# EAGLE board KickerBoard-new-switchreg-rerouted (EAGLE 9.5.1), part 1 of 2
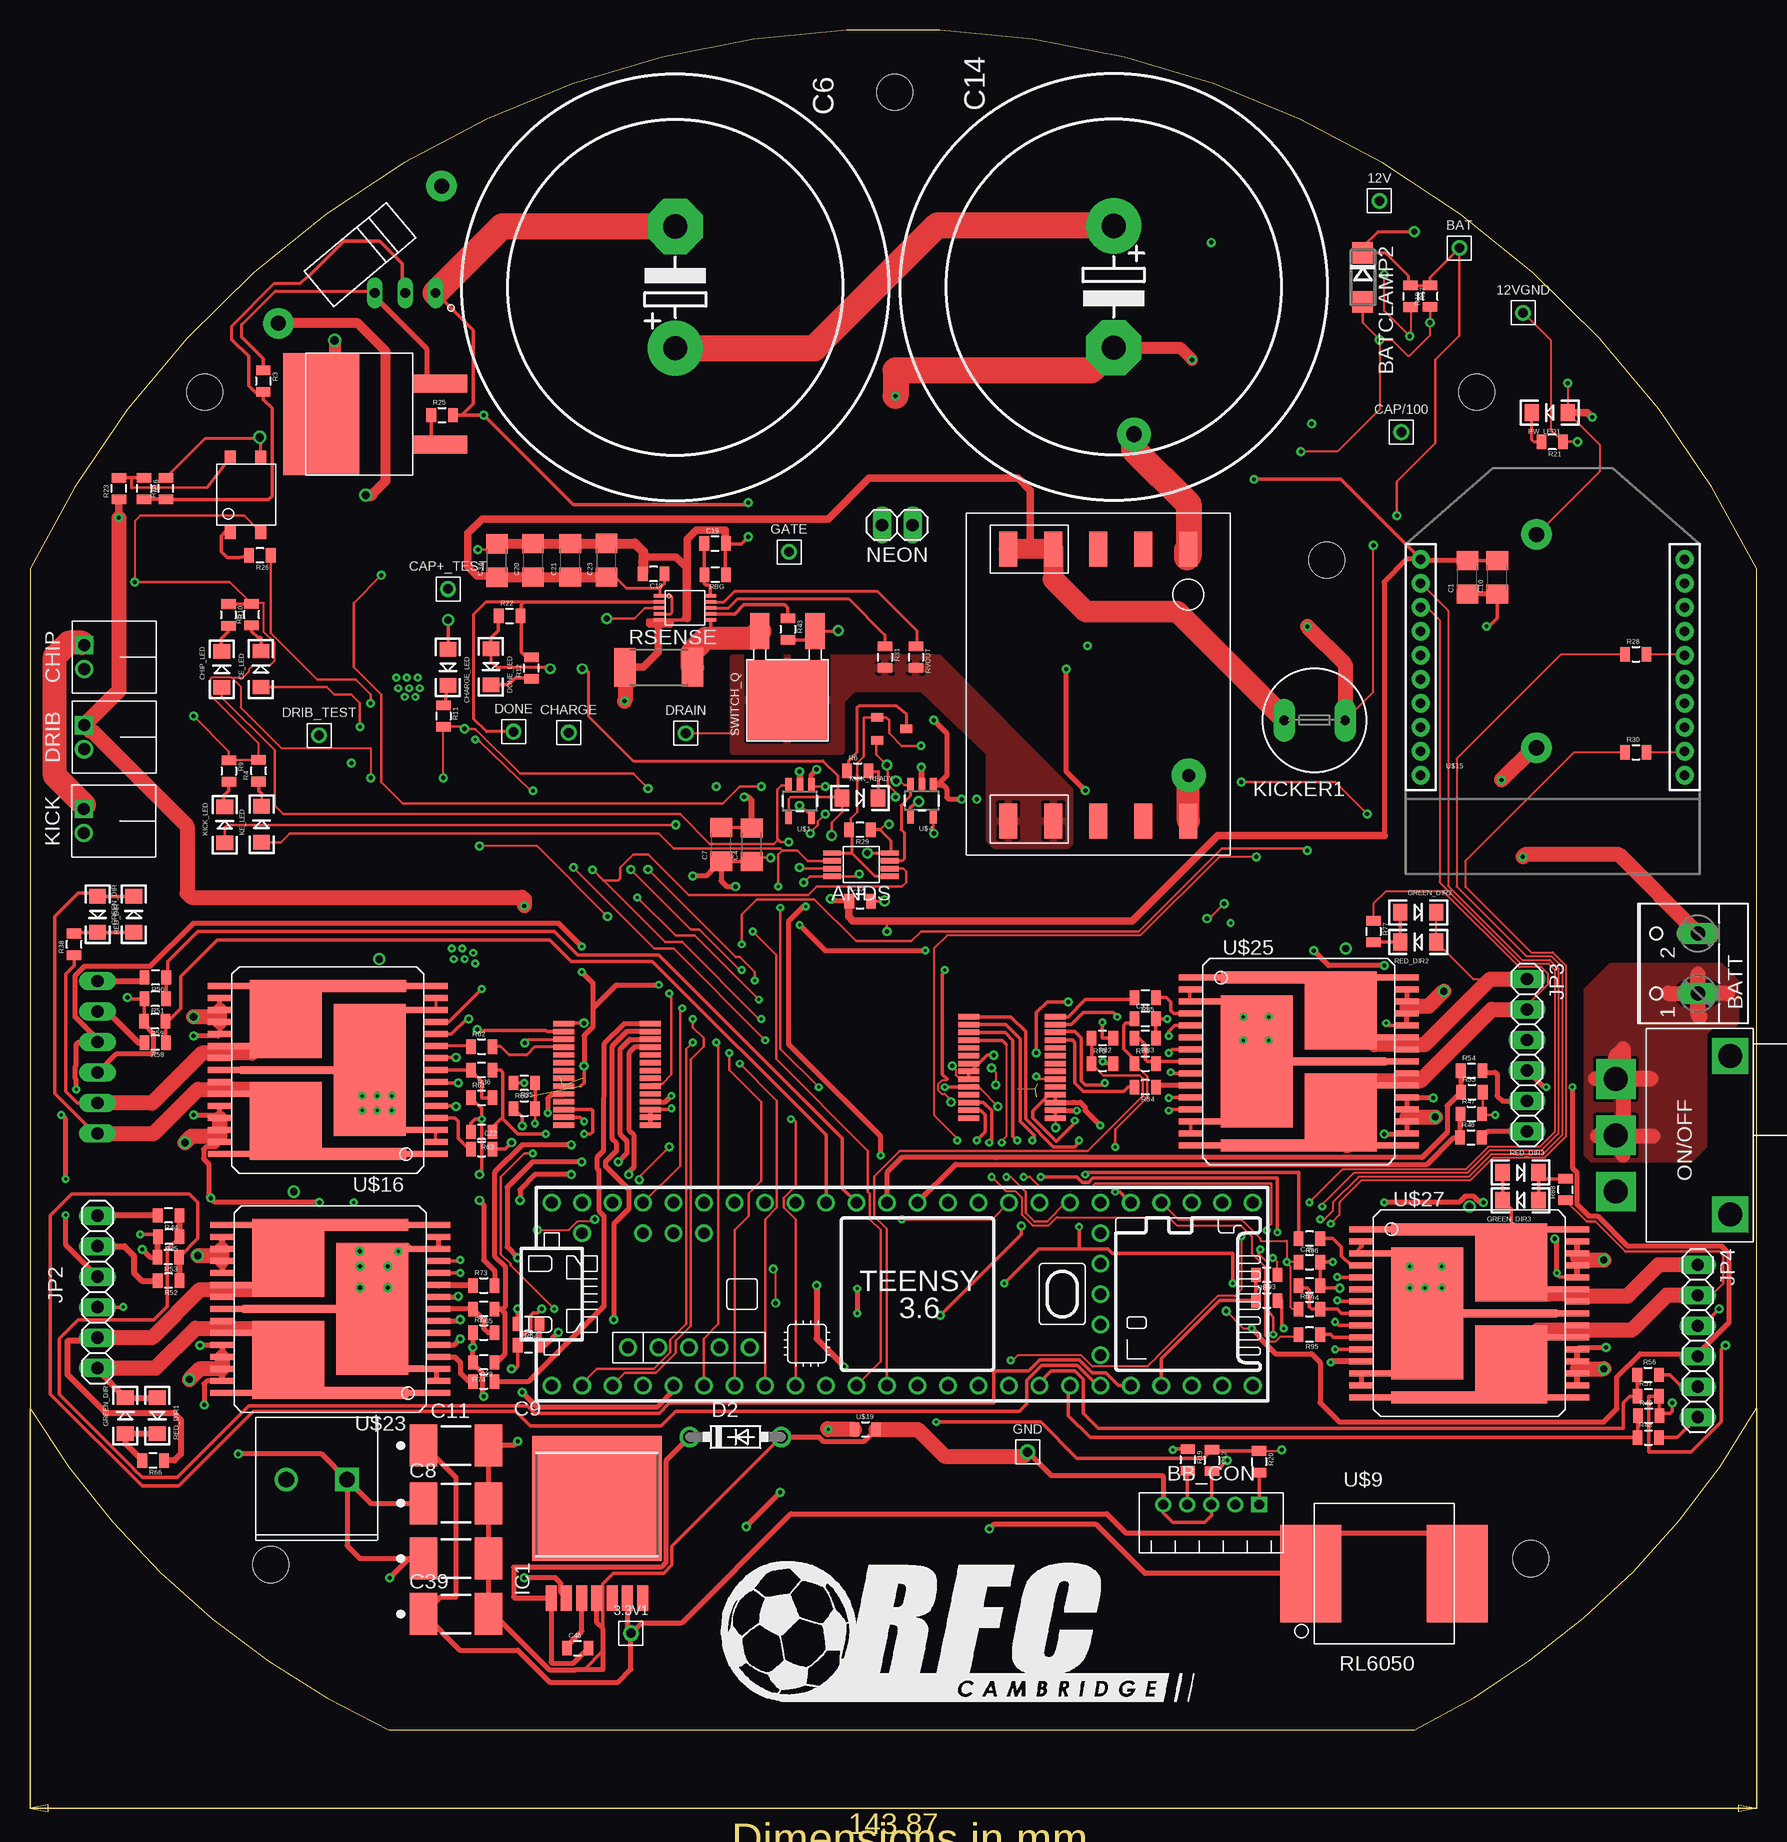
[diagram p3: board, top side]
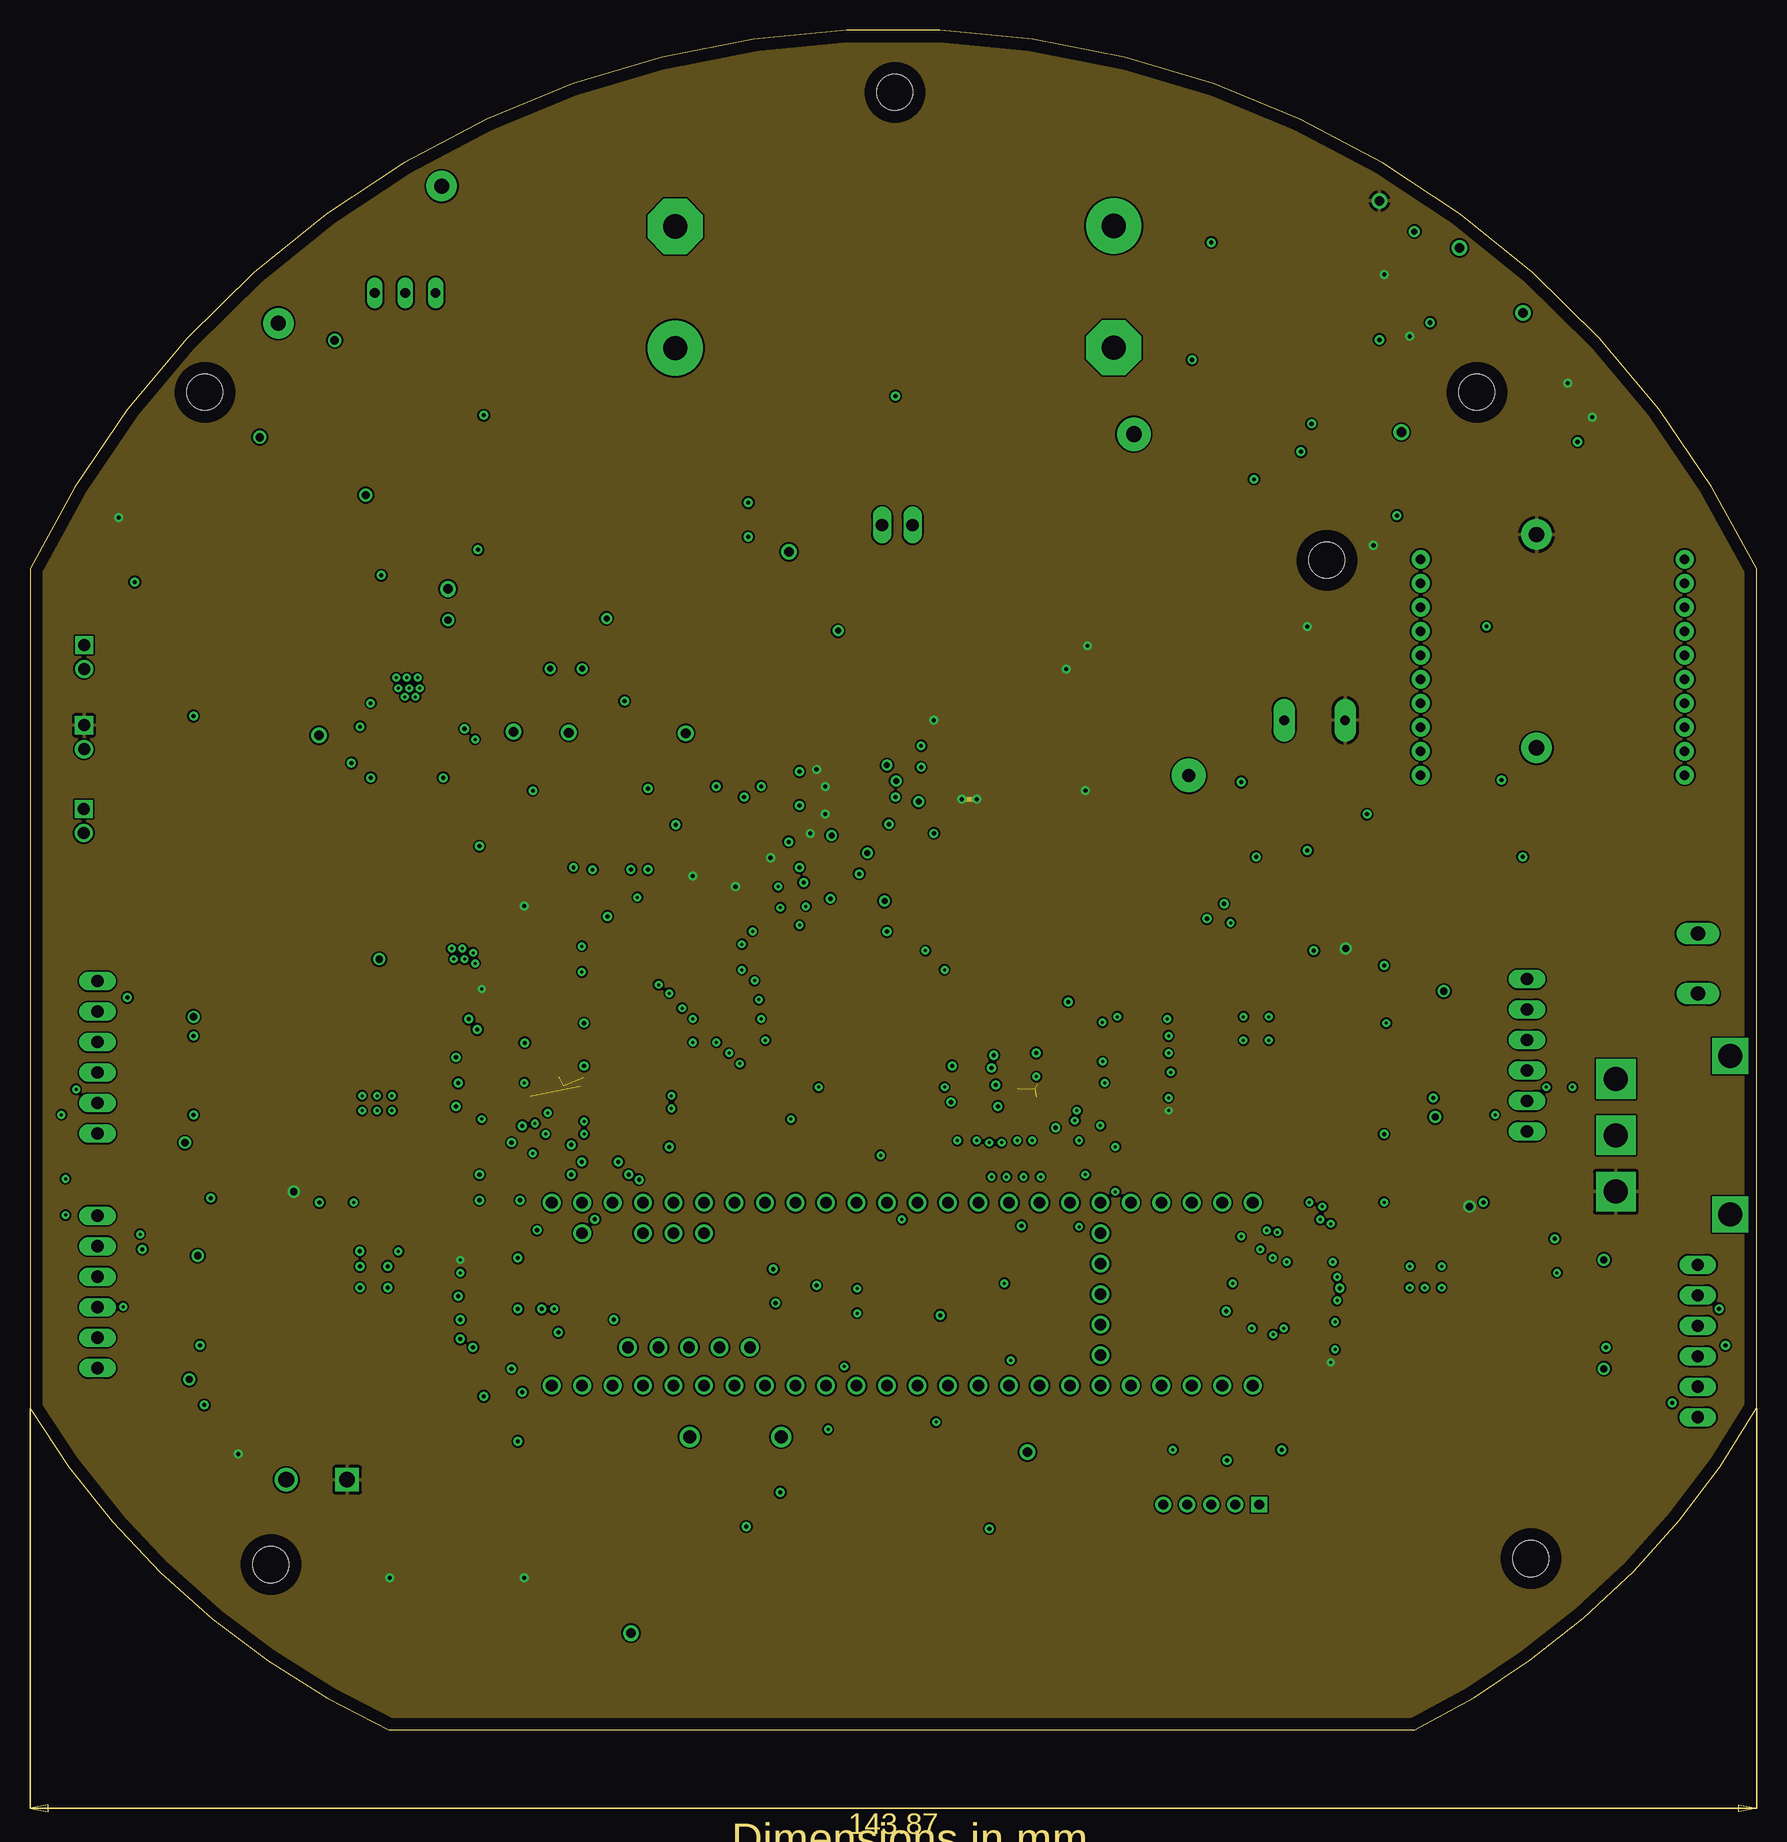
[diagram p4: board, inner layer 12V+]
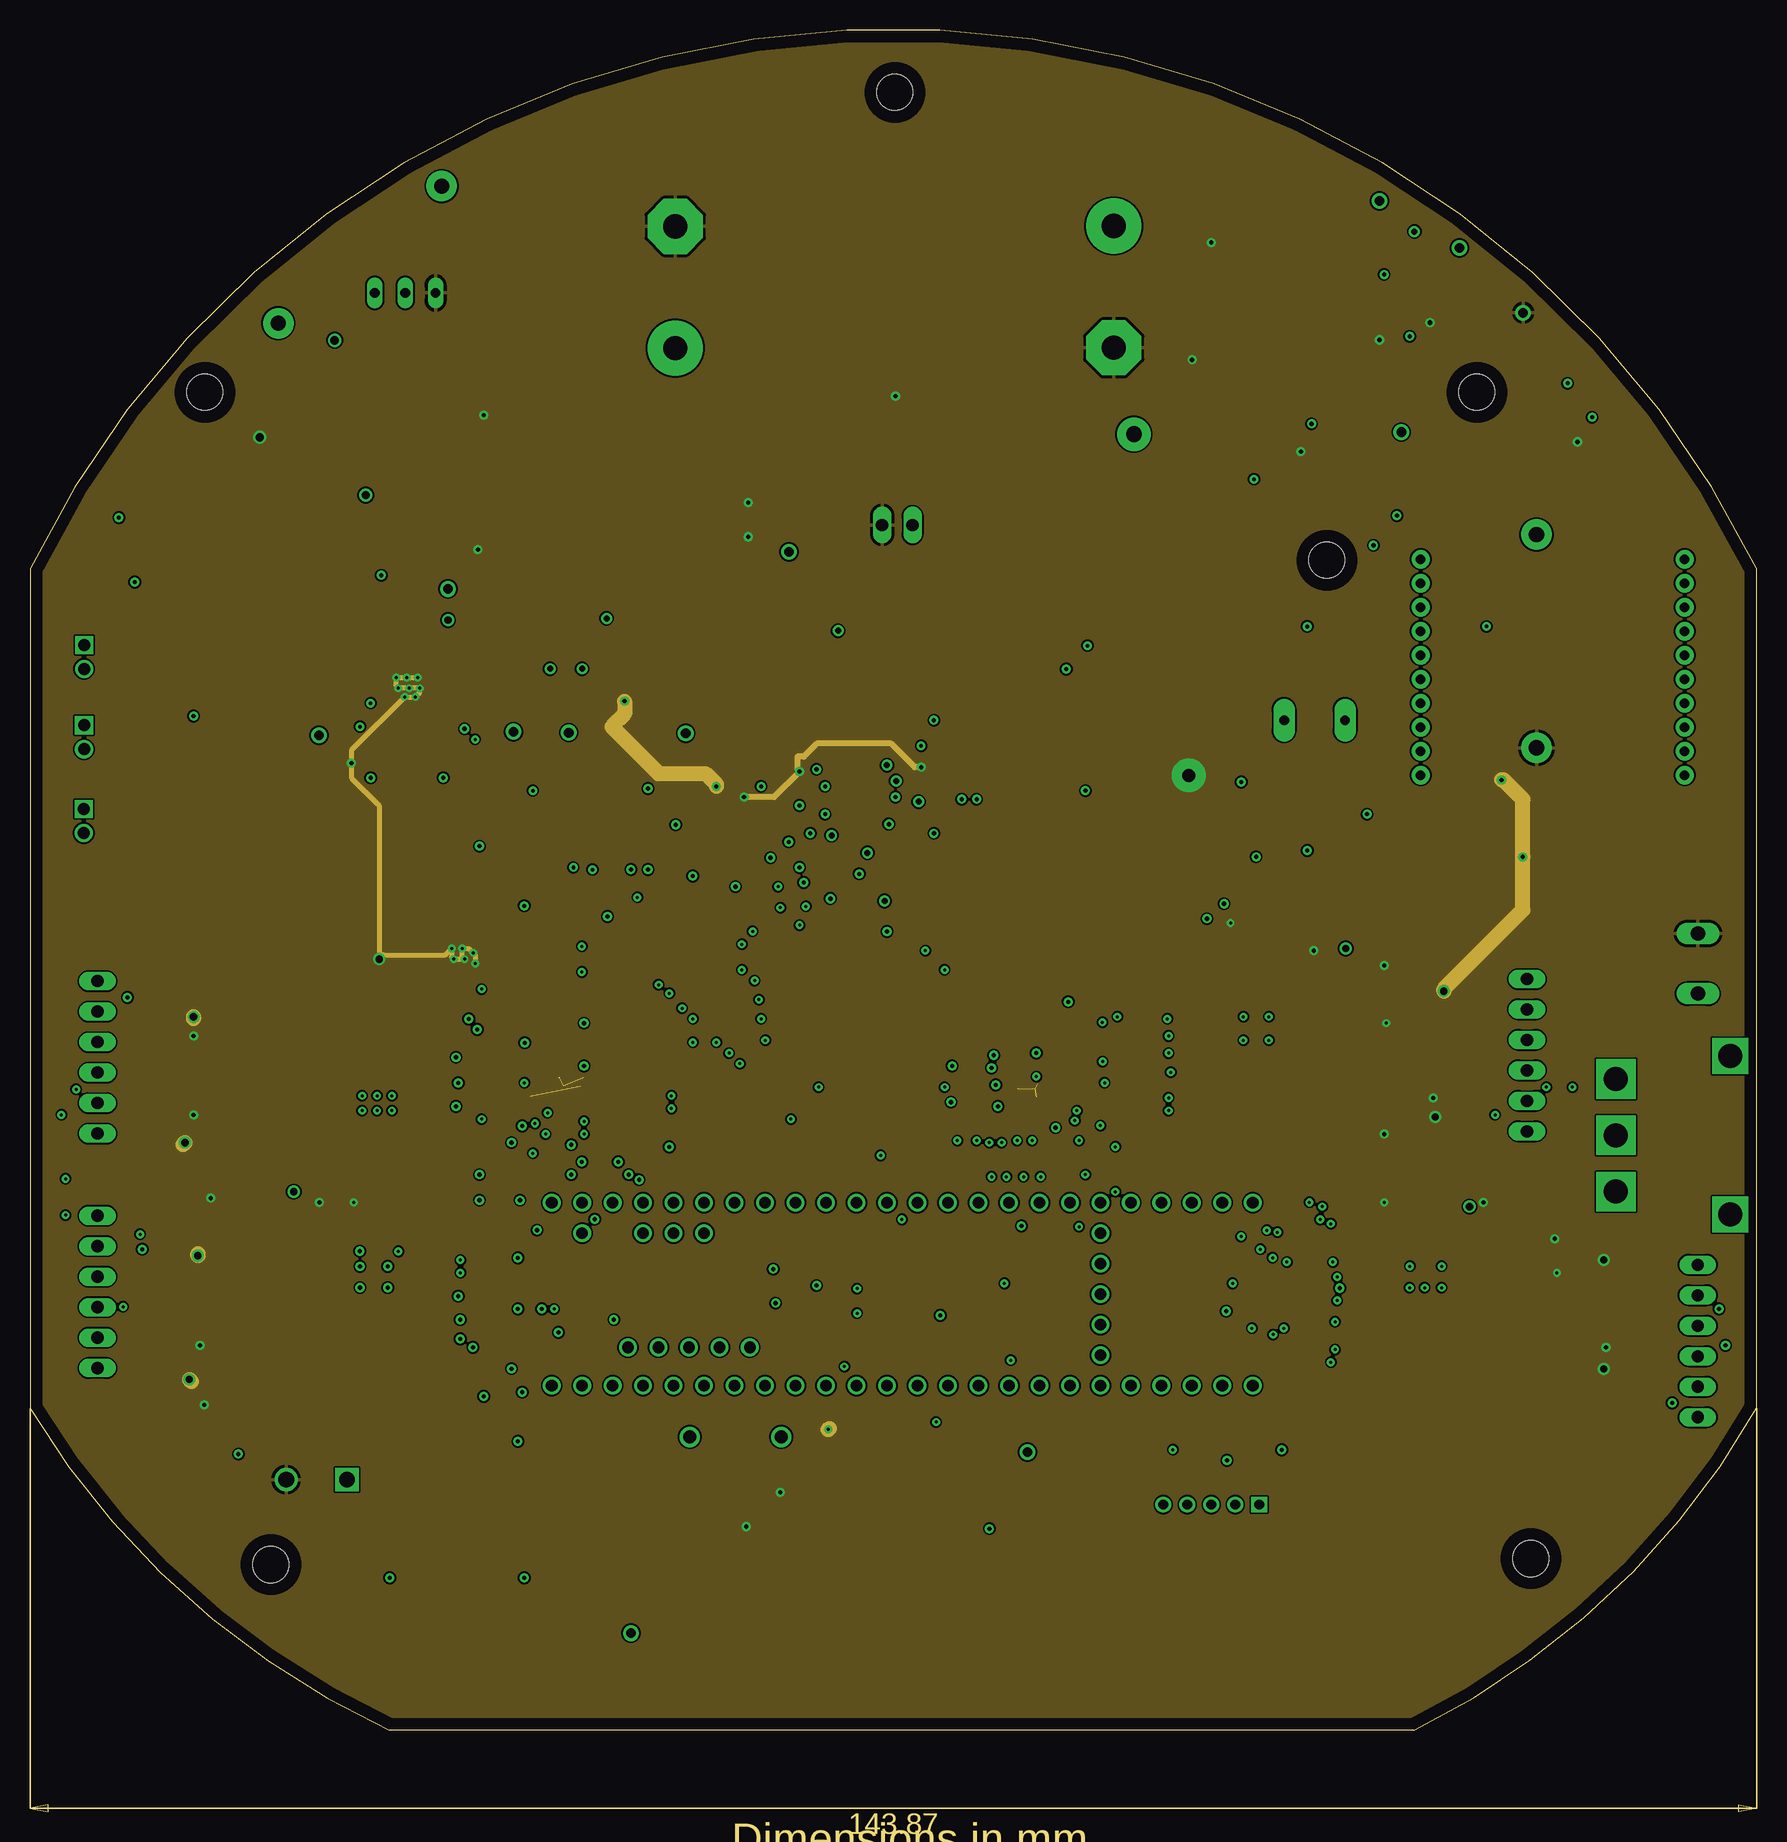
[diagram p5: board, inner layer 12VGND]
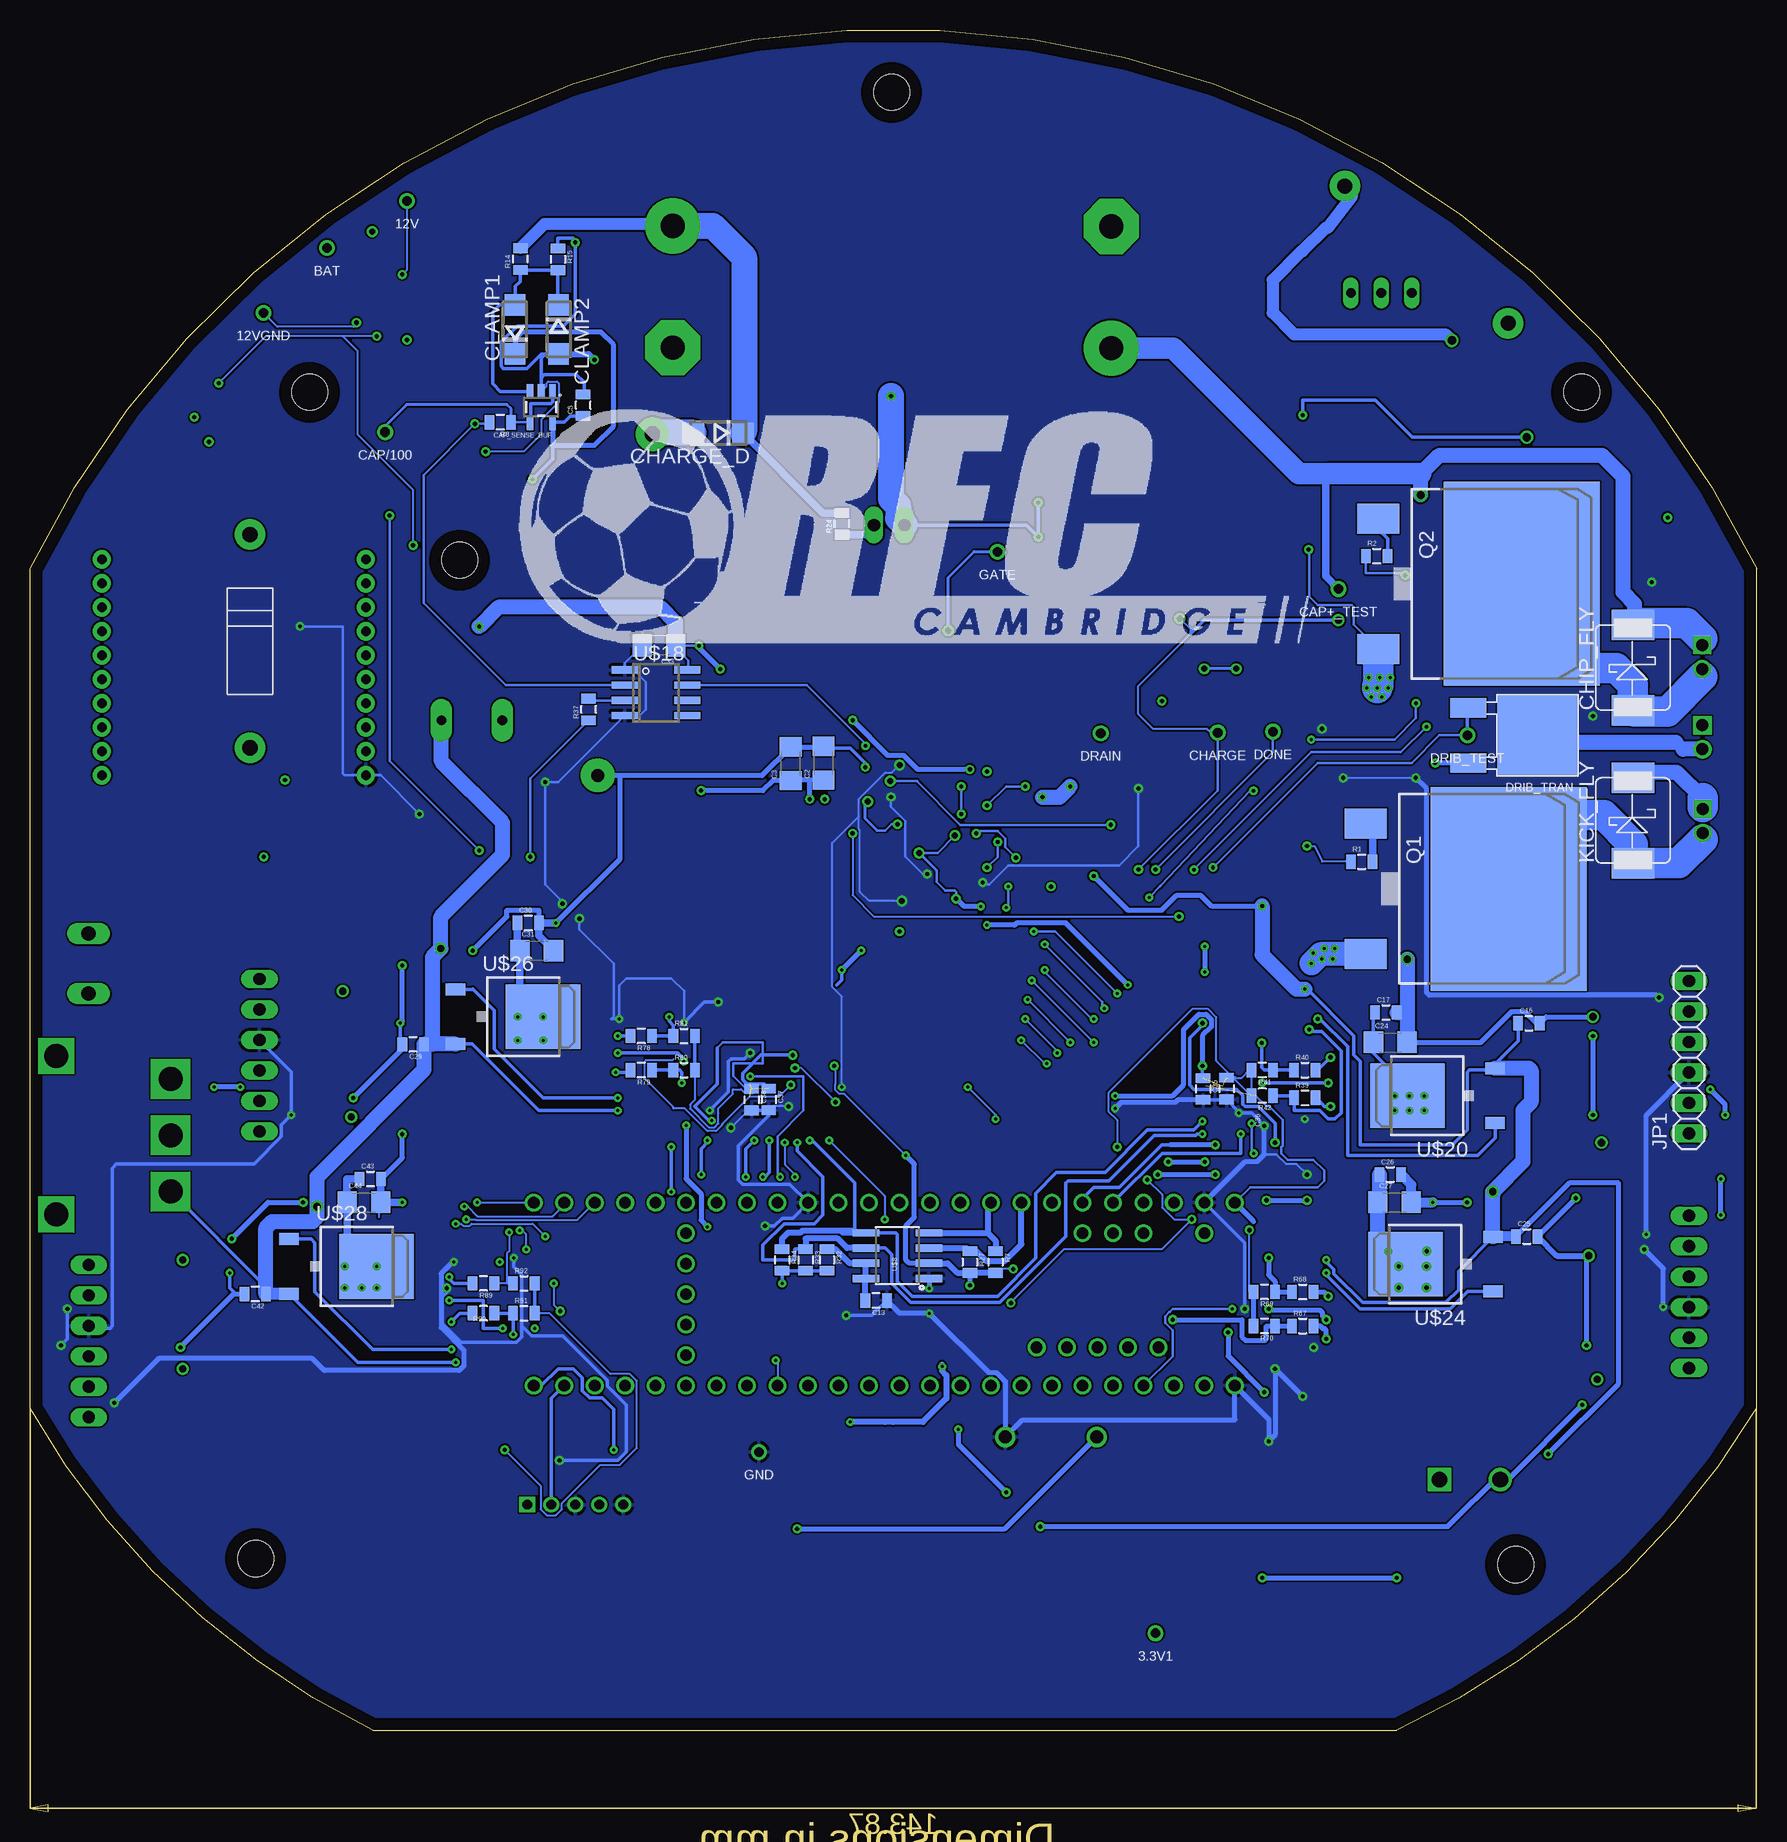
[diagram p6: board, bottom side, seen from below]

Size 143.88 x 141.72 mm. Coordinates in mm from the lower left corner, seen from the top.
Outline: 143.88,26.82 143.88,96.81 arc128 0,96.81 0,26.82 arc34 29.98,0 115.32,0 arc34 143.88,26.82
Copper layers (1*16): Top(3v3+) 0.035mm / dielectric 1.5mm / Bottom(3v3GND) 0.035mm
Design rules "default": minimum track width 6mil, minimum drill 0.35mm, track to track 6mil, track to pad 6mil, pad to pad 6mil, via to via 6mil, smd to smd 6mil, copper to edge 40mil, drill to drill 6mil, minimum pad ring 10mil, minimum via ring 8mil, stop-mask expansion 4mil, vias tented up to drill 0mil, thermal gap 10mil
Holes 3 mm at 125.07,14.3 20.07,13.8 14.57,111.52 72.07,136.52 108.07,97.52 120.57,111.52

## Footprints (pad centres in the part's own frame; a part is rotated, then mirrored left to right if it is on the bottom)
TESTING_PT = drill 0.8: P$1 0,0
TSSOP8 = smd 1.5 x 0.45: P$1 -2.4,0.975; P$2 -2.4,0.325; P$3 -2.4,-0.325; P$4 -2.4,-0.975; P$5 2.4,-0.975; P$6 2.4,-0.325; P$7 2.4,0.325; P$8 2.4,0.975
DO214AC = smd 1.8 x 1.7: A 2.05,0; C -2.05,0
W237-102 = drill 1.194 long: 1 -2.5,-1.27; 2 2.5,-1.27
JST-5-2MM = drill 0.8 square: 1 4,0 | drill 0.8: 2 2,0; 3 0,0; 4 -2,0; 5 -4,0
1206 = smd 1.6 x 1.8: 1 -1.4,0; 2 1.4,0
0805 = smd 0.8 x 1.2: 1 -0.9,0; 2 0.9,0
EB35D = drill 2.007 pad 4.597: + -5.08,0 | drill 2.007 pad 4.597 octagon: - 5.08,0
CAPCP7132X250N = smd 2.3 x 3.5: 1 -2.7,0; 2 2.7,0
SOT23-5 = smd 0.55 x 1.2: 1 -0.95,-1.3; 2 0,-1.3; 3 0.95,-1.3; 4 0.95,1.3; 5 -0.95,1.3
LED-1206 = smd 1.2 x 1.4: A -1.5,0; C 1.5,0
10-MSOP = smd 0.97 x 0.31: P$1 -0.485,-0.155; P$2 -0.485,-0.655; P$3 -0.485,-1.155; P$4 -0.485,-1.655; P$5 -0.485,-2.155; P$6 3.785,-2.155; P$7 3.785,-1.655; P$8 3.785,-1.155; P$9 3.785,-0.655; P$10 3.785,-0.155
JST-2-2MM = drill 1 square: 1 1,1 | drill 1: 2 -1,1
DO214AB = smd 2.54 x 3.556: ANODE 0,3.111; CATHODE 7.112,3.111
DO41-7.6 = drill 1.1 pad 1.7: A 3.81,0; C -3.81,0
DPAK = smd 6.7 x 6.7: DRAIN 0,0 | smd 3 x 1.6: GATE 5.75,-2.3; SOURCE 5.75,2.3
TO263-7 = smd 0.91 x 2.16: 1 -3.81,-5.78; 2 -2.54,-5.78; 3 -1.27,-5.78; 4 0,-5.78; 5 1.27,-5.78; 6 2.54,-5.78; 7 3.81,-5.78 | smd 10.8 x 10.41: 8 0,2.54
1X06 = drill 1.016 long: 1 -6.35,0; 2 -3.81,0; 3 -1.27,0; 4 1.27,0; 5 3.81,0; 6 6.35,0
TR5 = drill 0.813 pad 1.778 long: 1 -2.54,0; 2 2.54,0
1X02 = drill 1.016 long: 1 -1.27,0; 2 1.27,0
CK_SWITCH = drill 2 pad 3.302 square: COM 0,0; IN1 4.699,0; IN2 -4.699,0 | drill 2 pad 2.54 square: SUP1 -6.604,-9.525; SUP2 6.604,-9.525
TO268 = smd 8.5 x 13: C@1 -4.25,2.25; C@2 4.25,2.25 | smd 2.5 x 3.5: E 5.45,-9.7; G -5.45,-9.7
R2512 = smd 1.8 x 3.2: 1 -2.8,0; 2 2.8,0
TO-263 = smd 1.524 x 4.572: LOWER_LEFT 2.54,-2.286; LOWER_RIGHT 7.62,-2.286 | smd 10.16 x 6.35: TAB 5.08,7.62
10-TRANSFORMER = smd 2.92 x 1.52: P$1 0,0; P$2 0,-3.75; P$3 0,-7.5; P$4 0,-11.25; P$5 0,-15; P$6 22.67,-15; P$7 22.67,-11.25; P$8 22.67,-7.5; P$9 22.67,-3.75; P$10 22.67,0
SOP4 = smd 0.889 x 1.143: 1 0.813,-0.584; 2 3.353,-0.584; 3 3.353,5.664; 4 0.813,5.639
TO92 = drill 0.8 long: CENTER 2.54,0; LEFT 0,0; RIGHT 5.08,0
THROUGH-HOLE-2 = drill 1.27 pad 2.54: + 0,0; - 17.78,0
SOIC8 = smd 0.61 x 2.21: 1 -1.905,-2.616; 2 -0.635,-2.616; 3 0.635,-2.616; 4 1.905,-2.616; 5 1.905,2.616; 6 0.635,2.616; 7 -0.635,2.616; 8 -1.905,2.616
RL6050 = smd 5.08 x 8.12: P$1 -6.1,0; P$2 6.1,0
1X02-PHEONIX = drill 1.3 square: 1 0,0 | drill 1.3: 2 5.08,0
TEENSY_3.5/3.6 = drill 0.965: 0/RX -25.4,-7.62; 1/TX -22.86,-7.62; 2 -20.32,-7.62; 3/CANTX -17.78,-7.62; 3V3 7.62,-7.62; 3V3_2 17.78,-2.54; 3V3_LO -22.86,7.62; 4/CANRX -15.24,-7.62; 5 -12.7,-7.62; 6 -10.16,-7.62; 7 -7.62,-7.62; 8 -5.08,-7.62; 9/CS -2.54,-7.62; 10/CS 0,-7.62; 11/MOSI 2.54,-7.62; 12/MISO 5.08,-7.62; 13/SCK 5.08,7.62; 14/A0 2.54,7.62; 15/A1 0,7.62; 16/A2 -2.54,7.62; 17/A3 -5.08,7.62; 18/A4/SDA -7.62,7.62; 19/A5/SCL -10.16,7.62; 20/A6 -12.7,7.62; 21/A7 -15.24,7.62; 21/DAC0 12.7,7.62; 22/A8 -17.78,7.62; 23/A9 -20.32,7.62; 24 10.16,-7.62; 25 12.7,-7.62; 26 15.24,-7.62; 27 17.78,-7.62; 28 20.32,-7.62; 29 22.86,-7.62; 30 25.4,-7.62; 31/A12 27.94,-7.62; 32/A13 30.48,-7.62; 33/A14 30.48,7.62; 34/A15 27.94,7.62; 35/A16 25.4,7.62; 36/A17 22.86,7.62; 37/A18 20.32,7.62; 38/A19 17.78,7.62; 39/A20 15.24,7.62; A10 -17.78,5.08; A11 -15.24,5.08; A22/DAC1 10.16,7.62; AGND -25.4,7.62; AREF -20.32,5.08; GND -27.94,-7.62; GND2 7.62,7.62; GND3 17.78,0; PROG 17.78,2.54; RESET 17.78,5.08; U5V -21.59,-4.445; UD+ -16.51,-4.445; UD- -19.05,-4.445; UGND1 -13.97,-4.445; UGND2 -11.43,-4.445; VBAT 17.78,-5.08; VIN -27.94,7.62; VUSB -25.4,5.08
XBEE-1 = drill 0.8 pad 1.524: 1 -11,20; 2 -11,18; 3 -11,16; 4 -11,14; 5 -11,12; 6 -11,10; 7 -11,8; 8 -11,6; 9 -11,4; 10 -11,2; 11 11,2; 12 11,4; 13 11,6; 14 11,8; 15 11,10; 16 11,12; 17 11,14; 18 11,16; 19 11,18; 20 11,20
MULTIPOWERSO-30 = smd 0.508 x 12: 1 -7,-4; 15 7,-4; 16 7,4; 30 -7,4 | smd 0.508 x 2: 2 -6,-9; 4 -4,-9; 5 -3,-9; 6 -2,-9; 7 -1,-9; 8 0,-9; 9 1,-9; 10 2,-9; 11 3,-9; 12 4,-9; 14 6,-9; 17 6,9; 18 5,9; 19 4,9; 20 3,9; 22 1,9; 24 -1,9; 26 -3,9; 27 -4,9; 28 -5,9; 29 -6,9 | smd 0.508 x 4: 3 -5,-8; 13 5,-8; 21 2,8; 23 0,8; 25 -2,8 | smd 6.5 x 6: OUTA -4.25,3.5; OUTB 4.25,3.5 | smd 1 x 7.5: OUTA@1 -7,-2.755; OUTB@1 7,-2.755 | smd 11 x 6: VCC 0,-3.5 | smd 0.65 x 8.3: VCC@1 0,3.145
SSOP = smd 0.45 x 1.75: 1 0,0; 2 0.65,0; 3 1.3,0; 4 1.95,0; 5 2.6,0; 6 3.25,0; 7 3.9,0; 8 4.55,0; 9 5.2,0; 10 5.85,0; 11 6.5,0; 12 7.15,0; 13 7.8,0; 14 8.45,0; 15 8.45,7.2; 16 7.8,7.2; 17 7.15,7.2; 18 6.5,7.2; 19 5.85,7.2; 20 5.2,7.2; 21 4.55,7.2; 22 3.9,7.2; 23 3.25,7.2; 24 2.6,7.2; 25 1.95,7.2; 26 1.3,7.2; 27 0.65,7.2; 28 0,7.2
SOIC8' = smd 0.6 x 2.2: 1 -1.905,-2.6; 2 -0.635,-2.6; 3 0.635,-2.6; 4 1.905,-2.6; 5 1.905,2.6; 6 0.635,2.6; 7 -0.635,2.6; 8 -1.905,2.6
TO252-3 = smd 1 x 1.6: 1 -2.28,-6.07; 2 2.28,-6.07 | smd 5.4 x 6.2: 3 0,1.23
SOT-23 = smd 1 x 0.7: D 0,0; G -2.4,0.95; S -2.4,-0.95

## Placement (x,y rotation side)
3.3V1  TEST_PT  [TESTING_PT]  50.08,8.08 0 top
12V  TEST_PT  [TESTING_PT]  112.46,127.47 0 top
12VGND  TEST_PT  [TESTING_PT]  124.43,118.15 0 top
ANDS  AND-DUAL  [TSSOP8]  69.25,72.14 0 top
BAT  TEST_PT  [TESTING_PT]  119.12,123.54 0 top
BATCLAMP2  DIODE-ZENERDO214AC  [DO214AC]  111.06,121.1 270 top
BATT  [W237-102]  137.72,63.91 90 top
BB_CON  JST-5  [JST-5-2MM]  98.43,18.79 0 top
C1  1uF  [1206]  119.78,96.09 90 top
C2  .1uF  [1206]  77.74,80.61 90 bottom
C3  10uF  [1206]  80.48,80.56 90 bottom
C4  .1uF  [1206]  60.15,73.81 90 top
C5  .1uF  [0805]  97.78,110.45 90 bottom
C6  1500uF  [EB35D]  53.78,120.27 90 top
C7  10uF  [1206]  57.6,73.83 90 top
C8  594D127X06R3C2T(15UF)  [CAPCP7132X250N]  35.5,18.93 0 top
C9  594D127X06R3C2T(15UF)  [CAPCP7132X250N]  35.5,14.3 0 top
C10  .01uF  [1206]  122.27,96.09 90 top
C11  594D127X06R3C2T(180UF)  [CAPCP7132X250N]  35.5,23.73 0 top
C12  4.7uF  [0805]  98.49,22.48 270 top
C13  100nF  [0805]  73.37,35.82 180 bottom
C14  1500uF  [EB35D]  90.31,120.31 270 top
C15  .1uF  [0805]  69.17,69.1 0 top
C16  0.1uF  [0805]  18.96,58.93 0 bottom
C17  0.1uF  [0805]  30.88,59.82 0 bottom
C18  10uF  [0805]  51.96,96.38 180 top
C19  100pF  [0805]  57.09,98.92 0 top
C20  47uF  [1206]  41.93,97.51 90 top
C21  47uF  [1206]  45.02,97.52 90 top
C22  33nF  [0805]  37.63,49.86 180 top
C23  47uF  [1206]  48.04,97.52 90 top
C24  47uF  [1206]  30.52,57.33 0 bottom
C25  0.1uF  [0805]  19.14,41.15 0 bottom
C26  0.1uF  [0805]  30.52,46.31 0 bottom
C27  47uF  [1206]  30.17,44 0 bottom
C28  33nF  [0805]  37.81,30.66 180 top
C29  0.1uF  [0805]  111.95,57.15 180 bottom
C30  0.1uF  [0805]  102.35,67.29 0 bottom
C31  47uF  [1206]  101.64,64.98 0 bottom
C32  33nF  [0805]  92.93,59.29 0 top
C33  1uF  [1206]  91.47,90.41 180 bottom
C34  47uF  [1206]  38.9,97.49 90 top
C35  100nF  [0805]  46.12,53.45 270 bottom
C36  2.2uF  [0805]  44.16,53.47 270 bottom
C37  100nF  [0805]  82.31,52.58 270 bottom
C38  2.2uF  [0805]  83.73,52.56 270 bottom
C39  594D127X06R3C2T(180UF)  [CAPCP7132X250N]  35.5,9.68 0 top
C42  0.1uF  [0805]  125.11,36.35 180 bottom
C43  0.1uF  [0805]  115.51,45.95 0 bottom
C44  47uF  [1206]  116.04,44 0 bottom
C45  33nF  [0805]  106.62,39.02 0 top
C46  .01uF  [0805]  45.63,6.84 0 top
CAP+_TEST  TEST_PT  [TESTING_PT]  34.85,95.12 0 top
CAP/100  TEST_PT  [TESTING_PT]  114.28,108.2 0 top
CAP_SENSE_BUF  MCP6291T-E/OT  [SOT23-5]  101.27,110.28 180 bottom
CE_LED  [LED-1206]  19.24,88.45 90 top
CHARGE  TEST_PT  [TESTING_PT]  44.9,83.15 0 top
CHARGE_D  1kV, ultrafast  [DO214AC]  86.52,108.14 180 bottom
CHARGE_LED  [LED-1206]  34.83,88.6 270 top
CHARGE_U  LT3750  [10-MSOP]  52.93,94.7 0 top
CHIP  JST-22MM  [JST-2-2MM]  5.51,89.46 90 top
CHIP_FLY  DIODE-ZENERDO214AB  [DO214AB]  7.19,85.02 90 bottom
CHIP_LED  [LED-1206]  15.99,88.43 90 top
CLAMP1  DIODE-ZENERDO214AC  [DO214AC]  103.45,116.75 90 bottom
CLAMP2  DIODE-ZENERDO214AC  [DO214AC]  99.84,116.76 270 bottom
D2  1N5817-B  [DO41-7.6]  58.79,24.44 0 top
DONE  TEST_PT  [TESTING_PT]  40.3,83.23 0 top
DONE_LED  [LED-1206]  38.41,88.65 270 top
DRAIN  TEST_PT  [TESTING_PT]  54.65,83.11 0 top
DRIB  JST-22MM  [JST-2-2MM]  5.5,82.76 90 top
DRIB_TEST  TEST_PT  [TESTING_PT]  24.09,82.92 0 top
DRIB_TRAN  [DPAK]  18.26,82.92 180 bottom
GATE  TEST_PT  [TESTING_PT]  63.25,98.21 0 top
GND  TEST_PT  [TESTING_PT]  83.13,23.19 0 top
GREEN_DIR  [LED-1206]  8.65,68 90 top
GREEN_DIR1  [LED-1206]  7.94,26.22 90 top
GREEN_DIR2  [LED-1206]  115.69,68.18 0 top
GREEN_DIR3  [LED-1206]  124.22,44.17 180 top
IC1  LM2678S  [TO263-7]  47.24,16.79 0 top
JP1  [1X06]  5.63,56.09 90 bottom
JP2  [1X06]  5.63,36.53 90 top
JP3  [1X06]  124.76,56.26 270 top
JP4  [1X06]  138.98,32.44 270 top
KE_LED  [LED-1206]  19.3,75.51 90 top
KICK  JST-22MM  [JST-2-2MM]  5.49,75.79 90 top
KICK_FLY  DIODE-ZENERDO214AB  [DO214AB]  7.19,72.28 90 bottom
KICK_LED  [LED-1206]  16.23,75.47 90 top
KICK_READY  [LED-1206]  69.18,77.69 0 top
KICKER1  [TR5]  107.05,84.19 180 top
NEON  [1X02]  72.28,100.46 180 top
ON/OFF  SPDT-SWITCH  [CK_SWITCH]  132.15,49.59 90 top
PW_LED1  [LED-1206]  126.64,109.83 180 top
Q1  IXFT94N30P3  [TO268]  22.88,70.13 270 bottom
Q2  IXFT94N30P3  [TO268]  21.81,95.56 270 bottom
R1  100  [0805]  32.89,72.39 0 bottom
R2  100  [0805]  31.65,97.87 0 bottom
R3  250k  [0805]  19.44,112.45 270 top
R4  1k  [0805]  19.05,79.97 90 top
R5  1k  [0805]  18.47,93 90 top
R6  1k  [0805]  68.99,79.98 0 top
R7  4.7k  [0805]  63.41,39.02 270 bottom
R8  1k  [0805]  104.69,109.02 180 bottom
R9  1k  [0805]  16.58,79.94 270 top
R10  1k  [0805]  16.53,92.97 270 top
R11  1k  [0805]  34.45,84.53 270 top
R12  1k  [0805]  41.79,88.54 90 top
R13  2.5k  [0805]  11.33,103.5 90 top
R14  1M  [0805]  103.01,122.64 90 bottom
R15  10K  [0805]  99.88,122.6 270 bottom
R16  1k  [0805]  9.5,103.5 270 top
R17  80k  [0805]  115.05,119.52 270 top
R18  20k  [0805]  116.68,119.54 90 top
R19  20  [0805]  96.48,22.54 270 top
R20  100  [0805]  102.42,22.38 270 top
R21  1k  [0805]  126.85,107.37 180 top
R22  100k  [0805]  39.97,92.88 0 top
R23  1.5k  [0805]  7.4,103.5 90 top
R24  536k  [0805]  76.22,100.56 90 bottom
R25  200  [0805]  34.34,109.61 0 top
R26  300  [0805]  19.16,97.93 180 top
R27  4.7k  [0805]  65.55,39.02 270 bottom
R28  0  [0805]  133.82,89.69 0 top
R29  1M  [0805]  69.16,75.05 180 top
R30  0  [0805]  133.82,81.51 0 top
R31  43k  [0805]  71.25,89.44 270 top
R32  200k  [0805]  77.46,39.2 270 bottom
R33  4.7k  [0805]  79.24,39.2 270 bottom
R34  4.7k  [0805]  81.19,39.2 270 bottom
R35  1k  [0805]  41.19,53.95 180 top
R36  10k  [0805]  37.63,55.02 180 top
R37  100k  [0805]  97.32,85.09 90 bottom
R38  4.7k  [0805]  3.67,65.51 90 top
R39  1k  [0805]  37.63,52.71 0 bottom
R40  1k  [0805]  37.63,55.02 0 bottom
R41  1k  [0805]  41.19,55.02 180 bottom
R42  1k  [0805]  41.19,52.89 180 bottom
R43  100  [0805]  63.16,91.77 270 top
R44  39k  [0805]  11.55,42.9 180 top
R45  75k  [0805]  11.57,41.13 180 top
R46  39k  [0805]  120.08,49.41 0 top
R47  75k  [0805]  120.11,51.36 0 top
R48  39k  [0805]  134.87,24.39 0 top
R49  75k  [0805]  134.89,26.22 0 top
R50  39k  [0805]  10.46,62.74 180 top
R51  75k  [0805]  10.43,60.96 180 top
R52  39k  [0805]  11.55,37.47 180 top
R53  75k  [0805]  11.52,39.42 180 top
R54  39k  [0805]  120.13,54.97 0 top
R55  75k  [0805]  120.16,53.19 0 top
R56  39k  [0805]  134.84,29.62 0 top
R57  75k  [0805]  134.87,27.84 0 top
R58  39k  [0805]  10.43,57.31 180 top
R59  75k  [0805]  10.41,59.08 180 top
R60  10k  [0805]  41.19,51.82 0 top
R61  1k  [0805]  37.63,52.71 0 top
R62  1k  [0805]  37.63,56.98 0 top
R63  1k  [0805]  37.63,48.44 0 top
R64  1k  [0805]  41.55,33.86 180 top
R65  10k  [0805]  37.81,35.11 180 top
R66  4.7k  [0805]  10.25,22.48 180 top
R67  1k  [0805]  37.81,33.68 0 bottom
R68  1k  [0805]  37.81,36.53 0 bottom
R69  1k  [0805]  41.01,36.53 180 bottom
R70  1k  [0805]  41.01,33.68 180 bottom
R71  10k  [0805]  41.55,32.08 0 top
R72  1k  [0805]  37.81,33.15 0 top
R73  1k  [0805]  37.81,37.06 0 top
R74  1k  [0805]  37.81,29.06 0 top
R75  1k  [0805]  89.37,55.55 0 top
R76  10k  [0805]  92.93,55.55 0 top
R77  4.7k  [0805]  111.95,66.58 270 top
R78  1k  [0805]  92.93,57.87 180 bottom
R79  1k  [0805]  92.93,55.02 180 bottom
R80  1k  [0805]  89.37,55.02 0 bottom
R81  1k  [0805]  89.37,57.87 0 bottom
R82  10k  [0805]  89.37,57.69 180 top
R83  1k  [0805]  92.93,57.69 180 top
R84  1k  [0805]  92.93,53.6 180 top
R85  1k  [0805]  92.93,61.07 180 top
R86  1k  [0805]  103.06,35.82 0 top
R87  10k  [0805]  106.62,35.11 0 top
R88  4.7k  [0805]  127.96,45.06 90 top
R89  1k  [0805]  106.09,37.24 180 bottom
R90  1k  [0805]  106.09,34.75 180 bottom
R91  1k  [0805]  102.71,34.75 0 bottom
R92  1k  [0805]  102.71,37.24 0 bottom
R93  10k  [0805]  103.06,37.95 180 top
R94  1k  [0805]  106.62,37.06 180 top
R95  1k  [0805]  106.62,32.97 180 top
R96  1k  [0805]  106.62,40.97 180 top
RBG  2.49k  [0805]  57.1,96.31 180 top
RED_DIR  [LED-1206]  5.63,68 270 top
RED_DIR1  [LED-1206]  10.61,26.22 270 top
RED_DIR2  [LED-1206]  115.69,65.69 180 top
RED_DIR3  [LED-1206]  124.22,46.49 0 top
RSENSE  10m  [R2512]  52.39,88.59 0 top
RVOUT  50.4k  [0805]  73.83,89.44 270 top
SWITCH_Q  [DPAK]  63.12,85.86 90 top
U$1  FAN31111  [SOT23-5]  64.17,77.45 180 top
U$2  IXTA3N50D2  [TO-263]  31.88,104.62 90 top
U$3  32052-TRANSFORMER  [10-TRANSFORMER]  96.53,98.46 270 top
U$4  FAN31111  [SOT23-5]  74.32,77.49 180 top
U$5  VO1400AEFTR  [SOP4]  15.88,100.44 0 top
U$6  ZTX718  [TO92]  33.81,119.81 180 top
U$7  1N4007  [THROUGH-HOLE-2]  20.69,117.28 40 top
U$8  PCA9306  [SOIC8]  71.59,39.55 90 bottom
U$9  RL6050  [RL6050]  112.84,13.06 0 top
U$12  13VZENER  [THROUGH-HOLE-2]  125.55,81.88 90 bottom
U$13  PHEONIX-SCREW-TERM  [1X02-PHEONIX]  26.43,20.88 180 top
U$14  TEENSY_3.5/3.6  [TEENSY_3.5/3.6]  71.42,36.35 0 top
U$15  XBEE-1B1  [XBEE-1]  126.89,77.6 0 top
U$16  VNH5019  [MULTIPOWERSO-30]  24.83,55.02 90 top
U$17  IO-EXPANDER  [SSOP]  44.49,58.88 270 top
U$18  LM311  [SOIC8']  91.71,86.48 270 bottom
U$19  INDUCTOR  [0805]  69.61,25.07 0 top
U$20  MOSFET-NCH  [TO252-3]  27.85,52.89 90 bottom
U$21  IO-EXPANDER  [SSOP]  78.25,59.47 270 top
U$22  N-FET  [SOT-23]  73.02,83.47 0 top
U$23  VNH5019  [MULTIPOWERSO-30]  25.01,35.11 90 top
U$24  MOSFET-NCH  [TO252-3]  28.03,38.84 90 bottom
U$25  VNH5019  [MULTIPOWERSO-30]  105.73,55.73 270 top
U$26  MOSFET-NCH  [TO252-3]  102.35,59.47 270 bottom
U$27  VNH5019  [MULTIPOWERSO-30]  119.96,34.75 270 top
U$28  MOSFET-NCH  [TO252-3]  116.22,38.66 270 bottom

## Tracks (layer width: path | path; a pad name or v marks a point on that pad's centre or on a via)
3.3V  (via drill 0.25, 0.3, 0.35, 0.38, 0.5)  (5 unrouted)
  Top(3v3+) 0.152: v42.26,41.69 44.91,41.69 45.62,42.4 46.88,42.4 v47.07,42.59 47.23,42.75 | v62.13,35.6 62.13,38.34 61.99,38.48 v61.94,38.43 | v76.84,55.38 77.14,55.07 77.14,54.6 77.47,54.27 U$21.9 | v53.28,48.62 50.79,46.13 50.79,45.91 v50.76,45.88 | R20.1 104.22,23.28 v104.31,23.37
  Top(3v3+) 0.203: U$1.4 63.22,76.89 63.24,76.91 63.24,77.6 63.41,77.78 67.59,77.78 KICK_READY.A | C15.1 68.22,69.1 | 70.12,75.11 70.91,75.11 71.31,75.52 v71.57,75.52 | 67.33,77.69 KICK_READY.A | KICK_READY.A 67.68,76.53 66.79,75.64 v66.79,74.58 | 71.42,67.47 v71.42,66.58
  Top(3v3+) 0.254: v69.79,73.13 71.64,73.13 ANDS.P$8 71.72,73.19 71.72,74.15 70.81,75.05 R29.1 70.12,75.11 | U$4.4 73.37,76.97 v74.06,77.4 | DONE_LED.A 38.41,89.09 38.9,88.6 43.22,88.6 v43.35,88.47 | v46.02,88.47 46.27,88.47 46.52,88.22 46.52,84.53 50.26,80.8 66.08,80.8 67.33,79.56 67.33,77.69
  Top(3v3+) 0.305: DONE_LED.A 38.41,91.03 39.03,91.65 39.03,92.85 R22.1 | v102,104.27 109.22,104.27 U$15.1 | C1.2 C10.2 | R20.1 98.59,23.28 C12.1 97.77,22.66 87.24,22.66 84.22,25.68 v75.5,25.68 | v80.31,56.27 79.77,56.27 78.25,54.74 U$21.9
  Top(3v3+) 0.406: 68.22,69.1 66.91,69.1 v66.69,69.32 | C1.2 116,97.49 U$15.1 114.71,97.6 112.84,95.74 112.84,74.58 | v70.88,47.91 70.88,49.51 63.24,57.15 63.24,67.47 64.48,68.71 64.53,68.66 v64.66,68.66
  Top(3v3+) 0.508: v65.55,37.06 65.55,32.62 v67.86,30.31
  Top(3v3+) 0.61: 112.84,74.58 98.97,74.58 91.86,67.47 71.42,67.47 68.57,67.47 68.22,67.82 68.22,69.1
  Bottom(3v3GND) 0.152: 43.44,54.37 42.91,54.37 42.26,55.02 | R41.2 R42.2 45,55.8 45,59.41 45.69,60.1 47.03,60.1 54.02,53.12 54.02,51.59 53.28,50.86 v53.28,48.62 | R69.2 42.27,36.53 42.27,41.69 v42.26,41.69 | v62.13,35.6 62.03,35.6 61.99,35.64 61.99,35.82 57.73,40.09 49.58,40.09 v47.07,42.59 48.54,42.59 49.52,43.57 49.52,44.64 v50.76,45.88 | v61.94,38.43 63.1,38.43 R7.2 | v70.88,47.91 76.02,53.04 76.45,53.04 76.77,53.37 76.77,53.83 76.75,53.85 76.75,55.38 v76.84,55.38 | R80.2 88.47,52.55 88.87,52.16 88.87,51.82 87.29,50.25 86.83,50.25 86.51,50.57 86.51,51.44 86.53,51.46 86.53,51.81 85.31,53.03 85.31,53.4 85.28,53.42 84.62,53.42 84.3,53.1 83.6,53.1 83.38,53.32 83.38,53.64 83.6,53.86 83.96,53.86 | v104.31,23.37 101.32,20.38 101.32,18.43 100.8,17.91 100.07,17.91 99.55,18.43 99.55,18.92 96.37,22.1 94.73,22.1 93.31,23.52 93.31,29.13 93.88,29.7 95.52,29.7 100.58,34.75 R91.2
  Bottom(3v3GND) 0.203: v66.69,69.32 66.69,69.88 66.79,69.98 67.61,69.98 68.32,70.69 68.32,71.66 | v71.57,75.52 72.08,75.52 72.58,75.01 73.3,75.01 73.35,75.06 | v66.79,74.58 68.24,73.13 v69.79,73.13 | v71.41,66.57 v71.42,66.58
  Bottom(3v3GND) 0.254: 68.32,71.66 v69.79,73.13 | v74.06,77.4 74.31,77.14 74.31,76.03 73.35,75.06 | v43.35,88.47 v46.02,88.47
  Bottom(3v3GND) 0.305: C5.1 98.85,109.55 99.36,109.05 100.25,109.05 CAP_SENSE_BUF.5 | 100.32,107.12 100.32,105.95 v102,104.27 | 84.39,54.12 C38.1 | C37.1 82.69,53.85 84.12,53.85 84.5,54.23 84.5,54.75 82.98,56.27 v80.31,56.27 | R81.2 R80.2 | R92.2 R91.2 | 43.44,54.37 44.03,54.37 44.06,54.34 | 42.26,55.02 R41.2
  Bottom(3v3GND) 0.406: CAP_SENSE_BUF.5 100.32,107.12 96.84,107.12 95.24,108.72 95.24,115.47 96.31,116.54 102.89,116.54 103.45,115.97 CLAMP1.C | R27.2 v65.55,37.06 65.55,36.88 | U$8.2 70.6,38.92 70.88,39.2 70.88,42.04 70.17,42.75 70.17,47.2 v70.88,47.91 | v64.66,68.66 66.03,68.66 v66.69,69.32 | R70.2 R69.2
  Bottom(3v3GND) 0.508: R7.2 R27.2 66.6,38.12 67.4,38.92 U$8.2 | 67.86,30.48 v67.86,30.31 67.86,29.95 67.5,29.59 67.5,27.64 69.46,25.68 71.98,25.68 72,25.71 72.61,25.71 72.63,25.68 v75.5,25.68
5V  (via drill 0.25, 0.35)  (2 unrouted)
  Top(3v3+) 0.152: 76.44,54.27 76.33,54.16 75.99,54.16 75.66,53.83 75.66,53.37 75.99,53.04 76.24,53.04 76.75,52.53 v76.75,52.35 | v80.13,55.2 80.48,54.84 v80.48,53.78 | v99.69,34.93 101.11,33.51 v101.82,33.51
  Top(3v3+) 0.305: v46.17,55.38 46.17,53.95 45.9,53.68 | U$21.17 U$21.18 84.91,52.97 83.58,51.62 83.58,51.04 85.53,49.09 87.06,50.63 v87.06,50.8 | 76.44,54.27 76.04,54.66 76.04,63.02 76.22,63.2 v76.22,63.38 | v81.19,37.24 84.06,40.11 87.6,40.11 | 87.6,40.11 89.8,40.11 90.19,39.73 100.22,39.73 v100.22,37.24 | 87.6,40.11 87.42,40.29 v87.42,41.97
  Top(3v3+) 0.406: JP2.4 2.96,40.47 v2.96,42.93 | v2.96,45.95 2.96,50.93 v2.61,51.29 | v3.85,53.42 3.85,54.25 3.75,54.35 3.75,55.28 3.85,55.38 3.85,57.15 4.05,57.36 JP1.4 5.63,57.55 3.75,59.43 3.75,62.9 4.55,63.7 10.04,63.7 13.6,67.26 44.06,67.26 v45.99,65.33 | v46.17,55.38 46.17,57.89 46.9,58.63 46.9,60.18 | 46.9,60.18 46.9,62.29 v45.99,63.2 | JP3.4 126.15,53.6 v126.36,53.6 | v128.54,53.6 128.54,46.88 128.91,46.51 128.91,43.85 129.91,42.85 130.64,42.85 133.12,40.36 140.95,40.36 141.57,39.74 141.57,33.96 138.98,31.37 | 138.98,31.37 JP4.4 | U$17.18 52.95,52.38 v53.46,52.89 | 46.9,60.18 48.86,62.13 v52.39,62.13 | v64.13,67.11 66.26,64.98 v74.62,64.98 | v101.82,33.51 102.45,32.88 102.45,32.73 103.8,31.37 106.8,31.37 107.51,30.66 107.51,27.28 109.11,25.68 131.16,25.68 132.25,26.78 132.25,29.43 134.18,31.37 138.98,31.37 | U$21.17 86.95,52.31 86.96,52.33 87.52,52.33 87.92,51.93 87.92,51.67 v89.2,50.4
  Bottom(3v3GND) 0.152: v80.13,55.2 79.59,55.2 v76.75,52.35 | v80.48,53.78 81.19,53.06 | 81.19,53.06 81.46,52.8 83.89,52.8 | 81.19,53.06 81.41,53.06 81.67,52.8 83.92,52.8 86.2,50.51 86.2,50.45 86.71,49.94 87.42,49.94 89.3,51.82 90.26,51.82 90.26,51.93 92.66,54.33 92.66,55.72 92.52,55.85 90.32,55.85 90.26,55.91 | v100.22,37.24 100.22,35.46 v99.69,34.93
  Bottom(3v3GND) 0.203: 83.89,53.48 84.22,53.48 85.28,54.55 85.28,55.55 82.8,55.55 82.8,57.33 86.16,57.33 86.61,56.88 | 41.72,52.89 40.85,52.02 40.64,52.02 39.49,50.87 39.49,48.71 39.59,48.61 39.59,48.09 39.06,47.55 36.92,47.55 36.03,46.66 36.03,45.77 36.57,45.24 42.21,45.24 U$14.VIN
  Bottom(3v3GND) 0.305: v46.17,55.38 46.17,54.31 46.12,54.35 | 83.89,53.48 83.76,53.48 | R32.2 R33.2 R34.2 v81.19,37.24 | v76.22,63.38 76.22,62.53 76.64,62.11 | v87.06,50.8 87.3,50.8 87.87,51.38 87.87,51.39 88.48,52 86.61,53.87 86.61,56.88
  Bottom(3v3GND) 0.406: 41.91,42.41 U$14.VIN | v2.61,51.29 2.61,52.18 v3.85,53.42 | v2.96,42.93 v2.96,45.95 | v45.99,65.33 v45.99,63.2 | v126.36,53.6 v128.54,53.6 | v53.46,52.89 48.66,52.89 47.74,53.8 47.74,58.4 46.47,59.67 45.86,59.67 45.43,59.24 45.43,58.63 46.17,57.89 v46.17,55.38 | v52.39,62.13 57.55,67.29 61.64,67.29 61.81,67.11 v64.13,67.11 | v74.62,64.98 v76.22,63.38 | 101.81,33.52 v101.82,33.51 | v89.2,50.4 89.2,45.95 87.95,44.71 87.95,42.5 v87.42,41.97
12V  (via drill 0.25, 0.3, 0.35, 0.35 pad 0.75, 0.6)
  Top(3v3+) 0.152: R17.2 115.05,116.25 v114.98,116.18 112.84,118.32 v112.84,121.34 | v128.13,112.27 v128.14,112.26 PW_LED1.A 130.8,107.17 130.8,104.92 U$12.- | KICKER1.1 111.95,86.55 v111.95,98.76
  Top(3v3+) 0.203: C4.1 60.46,72.72 v61.72,72.72 | v66.26,76.36 65.65,75.74 65.65,75.44 65.02,74.81 v65.02,74.76 | v66.26,78.67 65.2,78.67 U$1.1
  Top(3v3+) 0.305: C4.1 57.63,72.41 C7.1 | U$25.12 94.97,51.73 v94.89,51.64 | U$16.12 34.88,59.02 v37.63,61.78 | v35.86,39.2 35.77,39.11 U$23.12
  Top(3v3+) 0.406: v58.79,70.31 58.08,70.31 57.6,70.79 C7.1 56.37,71.2 v55.24,71.2 | v77.64,77.6 76.57,77.6 76.39,77.78 76.39,78.49 76.1,78.78 U$4.1 75.62,78.78 76.39,79.56 76.39,83.11 v75.33,84.18 | U$1.1 65.12,79.66 v65.55,80.09 | v87.95,78.31 86.35,79.91 v86.35,88.45 | U$13.1 28.39,18.93 C8.1 | U$13.1 26.43,15.37 27.5,14.3 C9.1 31.59,14.3 v29.99,12.7 | U$13.1 24.3,23.02 v17.37,23.02 | IC1.2 44.24,11.47 44.24,12.24 43.77,12.7 v41.19,12.7
  Top(3v3+) 0.508: U$27.12 108.49,30.75 v108.4,30.66
  Top(3v3+) 0.61: v130.18,109.44 129.79,109.83 PW_LED1.A | R23.1 7.4,101.79 7.41,101.78 v7.41,101.07
  Top(3v3+) 1.27: v7.41,101.07 7.41,86.67 DRIB.1 4.96,83.31 5.14,83.31 13.1,75.35 13.1,69.78 13.45,69.42 41.01,69.42 41.19,69.24 v41.19,68.71 | v106.44,92 109.59,88.86 KICKER1.1
  12V+ 0.406: v77.64,77.6 v78.88,77.6
  Bottom(3v3GND) 0.152: v112.84,121.34 112.46,121.73 12V.P$1 | v114.98,116.18 117.82,116.18 | 117.82,116.18 124.22,116.18 v128.13,112.27 | 117.82,116.18 116.58,114.94 116.58,108 111.95,103.38 v111.95,98.76
  Bottom(3v3GND) 0.203: U$18.8 89.02,88.47 89.02,89.16 90.07,90.2 C33.1 88.31,90.41 v88.14,90.41 v88.13,90.4 | v61.72,72.72 62.6,73.61 62.6,74.31 63.23,74.93 64.84,74.93 v65.02,74.76 | v66.26,76.36 v66.26,78.67
  Bottom(3v3GND) 0.305: C16.1 19.87,57.44 21.78,55.52 U$20.2 21.93,55.02 23.94,55.02 24.12,54.84 24.12,50.04 25.37,48.8 33.01,48.8 33.01,55.73 33.55,56.27 33.55,57.87 37.46,61.78 v37.63,61.78 | v94.89,51.64 101.46,51.64 107.01,57.19 U$26.2 | v108.4,30.66 116.57,30.66 U$28.2 | U$24.2 24.83,38.25 24.83,36.71 25.9,35.64 32.83,35.64 35.22,38.03 35.22,38.39 35.86,39.02 v35.86,39.2 | ON/OFF.IN2 124.21,36.95 C42.1
  Bottom(3v3GND) 0.406: C2.1 78.88,79.21 | 78.88,79.21 80.44,79.21 C3.1 81.94,79.17 82.8,78.31 v87.95,78.31 | v78.88,77.6 78.88,79.21 | v55.24,71.2 52.39,68.36 49.55,68.36 48.3,69.6 46.35,69.6 45.46,68.71 v41.19,68.71 | v86.35,88.45 88.31,90.4 88.31,90.41 | v17.37,23.02 11.5,28.88 11.5,45.6 15.6,45.6 C25.1 | v41.19,12.7 v29.99,12.7 | v65.55,80.09 69.92,80.09 71.08,81.25 72.4,81.25 v75.33,84.18
  Bottom(3v3GND) 0.813: C25.1 21.93,41.15 U$24.2
  Bottom(3v3GND) 1.016: U$28.2 124.18,36.38 C42.1
  Bottom(3v3GND) 1.27: U$20.2 21.78,55.2 18.96,55.2 18.79,55.02 18.79,52.35 19.47,51.67 19.47,47.4 v21.99,44.89 21.99,44.71 21.96,44.68 U$24.2 | U$26.2 110.35,57.19 | 110.35,57.19 111.02,57.19 | 111.02,57.19 C29.1 | 110.35,57.19 110.35,64.44 v109.64,65.16 109.64,67.82 104.49,72.98 104.49,75.64 109.59,80.75 KICKER1.1 | C42.1 124.21,41.87 123.69,42.4 120.31,42.4 119.95,42.75 v119.95,43.64 119.95,46.13 111.02,55.06 111.02,57.19 | v41.19,68.71 41.19,64.62 38.34,61.78 v37.63,61.78 | C33.1 90.07,92.34 91.33,93.6 104.84,93.6 v106.44,92
  pour 12V+: -11.79,135.56 -11.79,15.55 17.19,-13.43 132.4,-13.43 151.96,6.13 151.96,125.96 131.51,146.41 -0.95,146.41
12V-KICKER
  Top(3v3+) 0.254: C18.1 52.86,95.57 52.49,95.2 52.49,95.08 | 52.49,95.08 52.49,94.6 CHARGE_U.P$1 52.46,94.57 53.38,94.57 53.51,94.44 53.51,93.17 53.39,93.05 CHARGE_U.P$4 | 48.03,96.11 48.79,96.11 49.7,95.2 52.37,95.2 52.49,95.08 | 48.02,96.12 C23.1
  Top(3v3+) 0.61: 82.97,98.46 83.35,98.84 83.35,103.33 82.34,104.35 69.89,104.35 66.51,100.97 37.68,100.97 36.49,99.78 36.49,96.98 37.25,96.22 40.68,96.22 40.65,96.19 40.65,96.12
  Top(3v3+) 0.813: C20.1 C21.1 48.03,96.11 C23.1 | 40.65,96.12 48.02,96.12 48.05,96.09 C34.1
  Top(3v3+) 1.676: 85.26,95.97 85.26,98.44 U$3.P$4 82.97,98.46 U$3.P$5
  Top(3v3+) 1.78: 85.26,95.97 87.98,93.25 95.6,93.25 104.51,84.33 KICKER1.2
12VGND  (via drill 0.25, 0.35, 0.35 pad 0.75, 0.38, 0.6, 0.7, 1.1 pad 2.79)
  Top(3v3+) 0.152: v105.91,106.58 108.93,106.58 112.46,110.11 v112.46,115.9 113.48,115.9 114.8,114.58 114.98,114.58 116.68,116.29 v116.68,117.33 | 12VGND.P$1 126.71,115.87 126.71,108.41 127.73,107.39
  Top(3v3+) 0.203: 64.15,78.73 U$1.2 | R21.1 127.73,107.39 v128.97,107.39 | R18.1 v116.68,117.33 | v112.46,115.9 111.06,117.31 BATCLAMP2.A | v37.33,98.4 38.42,98.4 C34.2
  Top(3v3+) 0.254: U$5.3 19.23,107.23 19.16,107.68 | 19.16,107.68 v19.14,107.78 | R13.2 14.61,107.68 19.16,107.68 | U$6.LEFT 33.89,119.73
  Top(3v3+) 0.305: 33.89,119.73 36.92,116.7 36.92,110.56 35.98,109.61 R25.2 35.25,109.61 v37.81,109.61 45.28,102.14 59.68,102.14 v59.86,102.31 | C7.2 60.12,75.23 C4.2 | 52.37,92.16 51.48,92.16 51.6,92.03 53.38,92.03 53.51,92.16 53.51,92.41 53.38,92.28 51.48,92.28 51.48,92.54 53.51,92.54 53.5,92.55 CHARGE_U.P$5 54.28,92.55 54.52,92.79 | 54.52,92.79 54.52,97.11 | 51.53,97.79 51.1,97.36 | 54.52,92.79 54.52,92.66 54.4,92.54 54.65,92.54 54.78,92.66 | 57.95,98.88 C19.2 57.95,98.95 | 57.95,98.88 57.95,96.36 RBG.1 | U$27.18 128.96,30.13 U$27.19 | U$27.27 128.96,39.37 U$27.28 | U$25.26 113.22,58.73 v113.02,58.93 | U$27.26 128.93,37.77 127.42,37.77 127.07,38.13 v127.25,38.13 | v59.86,99.47 59.27,98.88 57.95,98.88
  Top(3v3+) 0.406: U$16.19 U$16.20 15.68,57.87 v13.63,57.87 | U$16.18 U$16.17 | U$16.26 U$16.27 15.57,51.29 v13.63,51.29 | U$16.28 15.83,49.51 U$16.29 15.44,48.63 14.69,48.63 14.48,48.42 14.48,47.62 14.88,47.22 14.88,44.53 v15.05,44.35 15.41,44 v24.12,44 | U$25.29 U$25.28 114.73,60.35 | 114.73,60.18 U$25.27 U$25.26 | U$23.26 15.99,32.08 v14.16,32.08 | U$23.29 14.74,29.11 14.52,28.88 v14.52,27.11 | v62.53,19.82 v59.68,16.97 | U$27.20 129.11,31.91 v131.34,31.91 | v116.93,52.71 116.91,52.73 U$25.20 U$25.19 114.73,51.11 U$25.18 U$25.17 114.69,49.69 v112.84,49.69 | v127.25,38.13 127.25,40.79 v127.07,40.97 | v121.12,44 120.81,44 120.31,44.5 119.6,44.5 119.1,44 v112.84,44 | v112.84,63.73 108.22,63.73 v106.98,64.98
  Top(3v3+) 0.508: U$4.2 74.32,80.21 v74.26,80.27 | U$1.2 64.17,80.05 v64.13,79.91 | C4.2 60.14,77.49 59.86,77.78 v59.5,77.78 | U$23.26 U$23.27 | U$23.29 U$23.28 | U$23.18 U$23.17 | U$23.19 U$23.20 | U$27.17 U$27.18 | U$27.19 U$27.20 | U$27.26 U$27.27 | U$27.28 U$27.29
  Top(3v3+) 0.61: 52.37,92.16 52.37,89.87 51.1,88.6 RSENSE.1 | 54.52,97.11 53.84,97.79 51.53,97.79 | 54.78,92.66 54.78,99.27 55.54,100.03 57.95,100.03 57.95,98.95
  Top(3v3+) 0.813: C18.2 51.1,96.41 51.1,97.36 51.1,98.25 50.42,98.92 C23.2 48.03,98.92 C21.2 C20.2 41.91,98.89 C34.2
  Top(3v3+) 1.016: C14.- 95.84,115.23 v96.84,114.23
  Top(3v3+) 1.27: RSENSE.1 49.59,85.83 v49.55,85.78 | U$16.18 U$16.19 15.39,59.47 v13.63,59.47 | U$16.28 U$16.27 15.83,49.51 13.45,49.51 v12.92,48.98 | U$23.27 U$23.28 14.14,30.11 v13.28,29.24 | U$23.19 U$23.18 15.46,39.55 v13.99,39.55 | 114.73,60.18 114.73,60.35 116.58,60.35 v117.82,61.6 | 114.73,51.11 v117.11,51.11 | 128.96,30.13 v131.16,30.13 | 128.96,39.37 129.13,39.2 v131.16,39.2 | U$19.1 v66.51,25.07 66.44,25.15 | v122.62,79.2 125.3,81.88 U$12.+ | BATT.2 132.42,72.98 124.58,72.98 v124.4,72.8
  Top(3v3+) 1.93: U$3.P$10 96.53,79.55 v96.56,79.58
  Top(3v3+) 2.184: U$6.LEFT 39.34,125.35 C6.- | C14.- 88.42,113.34 72.13,113.34 v72.13,111.2
  12VGND 0.406: v32.3,87.73 v31.41,87.73 v30.52,87.73 30.52,87.02 v30.7,86.85 v31.59,86.85 v32.48,86.85 32.48,86.49 v32.12,86.14 v31.23,86.14 26.79,81.69 v26.79,80.62 26.79,79.38 29.1,77.07 v29.1,64.27 29.45,64.62 34.61,64.62 v35.14,65.16 35.14,64.44 v35.32,64.27 v36.21,64.27 36.03,64.44 v36.03,65.16 36.57,65.16 v36.92,64.8 37.1,64.62 v37.1,63.91
  12VGND 0.508: v74.26,80.27 73.73,80.27 71.77,82.22 65.55,82.22 64.48,81.16 63.95,81.16 63.95,80.09 v64.13,79.91 61.99,77.78 v59.5,77.78
  12VGND 1.27: v49.55,85.78 49.55,84.71 48.48,83.65 52.39,79.73 56.3,79.73 57.19,78.84 v57.19,78.67 | v13.63,59.47 13.63,59.29 | v12.92,48.98 12.74,48.8 | v13.28,29.24 13.45,29.06 | v13.99,39.55 13.99,39.73 | v117.82,61.6 117.82,61.78 124.4,68.36 v124.4,72.8 124.4,77.6 122.8,79.2 v122.62,79.2 | v66.51,25.07 66.54,25.07 66.61,25.15
  Bottom(3v3GND) 0.152: C5.2 97.7,111.43 | CLAMP2.A 100.14,114.71 100.22,114.63 | C43.2 114.8,45.76 114.8,42.75 | CAP_SENSE_BUF.2 100.82,112.03 100.82,112.27 100.69,112.41 99.95,112.41 99.82,112.27 99.82,110.71 101.27,109.26 101.27,108.02 102.71,106.58 v105.91,106.58 | 116.88,116.97 123.25,116.97 12VGND.P$1
  Bottom(3v3GND) 0.203: v116.68,117.33 116.68,117.17 116.88,116.97 | Q2.E 33.55,92.14 33.55,93.6 33.72,93.78 36.57,93.78 37.28,94.49 37.28,98.36 v37.33,98.4
  Bottom(3v3GND) 0.305: 99.92,114.63 100.22,114.63 101.01,114.63 101.27,114.37 CAP_SENSE_BUF.2 101.27,112.72 101.01,112.98 98.34,112.98 97.7,112.35 97.7,111.43 | R15.1 99.88,124.35 99.69,124.36 98.62,124.36 v98.44,124.01 98.44,118.03 99.42,117.05 103.29,117.05 104.61,115.73 104.61,113.68 104.43,113.5 102.47,113.5 101.26,114.71 CLAMP2.A | v74.26,80.27 74.26,80.62 75.5,81.87 77.69,81.87 77.78,81.97 | v113.02,58.93 113.02,57.32 C29.2 | v127.25,38.13 127.25,36.88 126.71,36.35 C42.2 | v19.14,107.78 28.69,107.78 31.77,110.85 37.81,110.85 v37.81,109.61 | v59.86,102.31 v59.86,99.47 60.85,100.46 NEON.2
  Bottom(3v3GND) 0.406: C2.2 77.78,81.97 C3.2 82.89,79.56 94.71,79.56 | DRIB_TRAN.SOURCE v26.79,80.62 | v13.63,59.47 17.53,59.47 C16.2 18.36,58.93 19.32,59.89 20.41,59.89 22.97,57.33 C24.2 | v96.56,79.58 96.54,79.56 94.71,79.56 | v100.04,67.29 94.71,72.62 94.71,79.56 | v15.05,44.35 15.05,44.34 C25.2 | v26.97,44 v24.12,44 | v13.63,57.87 v13.63,51.29 | v14.16,32.08 14.16,39.37 v13.99,39.55 | v14.52,27.11 20.74,20.88 U$13.2 21.28,20.96 21.28,21.42 25.72,16.97 v59.68,16.97 | v66.51,25.07 66.51,23.8 v62.53,19.82 | v131.34,31.91 126.89,36.35 C42.2 | v116.93,52.71 112.85,56.79 C29.2 | C43.2 112.84,47.72 v112.84,49.69 | v127.07,40.97 124.04,44 v121.12,44 | v113.02,58.93 112.84,59.11 v112.84,63.73 | v106.98,64.98 104.13,67.82 104.13,68.36 101.46,68.36 C30.2
  Bottom(3v3GND) 0.508: CLAMP2.A 97.32,114.71 v96.84,114.23 | C25.2 16.64,39.55 v13.99,39.55
  Bottom(3v3GND) 0.61: C43.2 114.64,45.92 C44.2 v112.84,44 | C31.2 101.29,66.02 101.29,66.04 101.46,66.22 C30.2 v100.04,67.29
  Bottom(3v3GND) 0.813: C26.2 28.77,45.45 C27.2 v26.97,44
  Bottom(3v3GND) 1.27: C17.2 29.12,59.82 C24.2 29.12,64.24 v29.1,64.27 | v36.21,64.27 36.33,64.38 36.33,64.68 | v59.5,77.78 58.08,77.78 v57.19,78.67
  Bottom(3v3GND) 2: Q1.E 36.33,64.68 v37.1,63.91
  Bottom(3v3GND) 2.184: v72.13,111.2 72.13,102.64 71.54,102.05 71.54,100.99 NEON.2
  Bottom(3v3GND) 2.54: Q2.E 31.51,87.1 31.59,87.02 v31.59,86.85
  pour 12VGND: -16.59,298.78 307.18,-24.99 -16.59,-24.99
BAT+
  Top(3v3+) 1.27: ON/OFF.IN1 135.05,54.29 135.07,54.31 132.13,54.31 | 130.45,54.31 132.13,54.31 | 132.13,54.31 ON/OFF.IN1 | ON/OFF.IN1 132.15,56.2 132.76,56.8 132.76,49.52 | 132.76,47.91 132.76,49.52 | ON/OFF.COM 130.7,49.59 130.62,49.51 132.77,49.51 | 135.25,49.51 132.77,49.51 | 132.77,49.51 132.76,49.52 | BATT.1 138.99,63.01 138.98,63.02 138.98,59.64 | 139.16,59.47 138.99,59.63 BATT.1 | 136.49,61.42 138.97,61.42 BATT.1 | 141.46,61.41 BATT.1
  pour Top(3v3+): 131.69,63.91 140.94,63.91 142.36,62.49 142.36,58.93 142,58.58 140.22,58.58 139.69,58.04 139.69,48.62 138.45,47.37 130.09,47.37 129.56,47.91 129.56,61.78
BATSENSE  (via drill 0.25, 0.35, 0.5)
  Top(3v3+) 0.203: v106.44,73.33 106.44,73.51 99.33,73.51 92.4,66.58 74.27,66.58 73.46,65.77 68.84,65.77 65.37,69.24 60.57,69.24 59.33,68 v59.33,65.51 | v113.91,101.25 113.91,104.09 117.11,107.29 117.11,114.23 119.12,116.24 BAT.P$1 | U$14.23/A9 54.17,47.05 54.17,60 v54.35,60.18
  Top(3v3+) 0.254: BAT.P$1 116.68,121.1 R18.2 116.66,120.42 R17.1 114.85,120.62 114.85,121.24 112.94,123.15 BATCLAMP2.C | v115.36,124.92 112.33,124.92 111.06,123.64
  Top(3v3+) 0.406: BATCLAMP2.C 111.06,123.64
  Bottom(3v3GND) 0.203: v106.44,73.33 113.91,80.8 v113.91,101.25 | v59.33,65.51 54.52,60.71 54.52,60.35 v54.35,60.18
  Bottom(3v3GND) 0.406: v115.36,124.92 115.1,124.92
BB_IN
  Bottom(3v3GND) 0.305: U$14.31/A12 100.44,27.65 BB_CON.2
BB_OUT  (via drill 0.25)
  Top(3v3+) 0.305: v95.24,23.37 95.31,23.44 R19.1
  Bottom(3v3GND) 0.305: U$14.32/A13 101.26,28.73 99.86,30.13 98.62,30.13 97.86,29.37 97.86,28.3 97.25,27.69 96.18,27.69 95.24,26.75 v95.24,23.37
CAP+  (via drill 0.7)
  Top(3v3+) 0.813: 28.44,102.95 29.63,104.14 29.63,114.94 27.29,117.28 U$7.+
  Top(3v3+) 1.016: v27.98,102.95 28.44,102.95 | KICK.1 4.49,76.96
  Top(3v3+) 1.27: 2.07,79.56
  Top(3v3+) 1.5: 4.33,90.64 CHIP.1 | KICK.1 4.49,77.14
  Top(3v3+) 2: 4.33,90.64 3.21,90.64 2.07,89.5 2.07,79.56 4.49,77.14
  Top(3v3+) 2.184: C6.+ 65.36,115.19 75.61,125.43 90.27,125.43 C14.+
  Bottom(3v3GND) 0.203: 4.49,76.96 KICK.1
  Bottom(3v3GND) 0.61: R24.2 77.79,101.46 CHARGE_D.C | 35.91,104.73 35.91,96.19 CAP+_TEST.P$1
  Bottom(3v3GND) 0.813: 9.85,79.84 KICK_FLY.CATHODE | 10.15,92.28 CHIP_FLY.CATHODE
  Bottom(3v3GND) 1.016: C14.+ 90.49,125.57 100.98,125.57 R14.2
  Bottom(3v3GND) 1.27: 9.85,79.84 6.65,79.84 4.49,77.68 | CHIP.1 4.51,90.98 | 10.15,92.28 10.15,93.88 11.12,94.85 11.12,104.5 12.89,106.28 26.43,106.28 27.98,104.73 v27.98,102.95 | 35.73,104.73 35.91,104.73
  Bottom(3v3GND) 1.778: C6.+ 48.6,115.19 38.14,104.73 35.91,104.73 | 27.98,104.73 35.73,104.73 | 90.27,125.43 C14.+
  Bottom(3v3GND) 2.184: C14.+ 87,125.39 84.37,122.76 84.37,108.24 CHARGE_D.C
  Bottom(3v3GND) 2.54: 4.51,90.98 5.81,92.28 10.15,92.28 | 4.49,76.96 4.49,77.68
CHARGE  (via drill 0.25, 0.35, 0.5, 0.6)
  Top(3v3+) 0.203: v48.05,92.66 50.33,92.66 51.22,93.55 CHARGE_U.P$3 | v55.24,57.33 54.7,56.8 54.7,33.86 53.36,32.52 53.36,31.5 51.99,30.13 47.23,30.13 46.02,28.91 U$14.0/RX | v51.5,71.73 58.79,64.44 59.15,64.44 60.39,63.2 v60.39,62.49
  Top(3v3+) 0.305: CHARGE_LED.A v34.84,92.54
  Bottom(3v3GND) 0.178: CHARGE.P$1 45.5,83.15 45.81,83.47 50.26,83.47 51.5,84.71 51.5,87.05 46.54,92.02
  Bottom(3v3GND) 0.203: 47.16,91.39 47.16,91.77 v48.05,92.66 | v51.5,71.73 44.9,78.34 CHARGE.P$1 | v60.39,62.49 v55.24,57.33
  Bottom(3v3GND) 0.305: v34.84,92.54 46.02,92.54 46.54,92.02 47.16,91.39
CHARGE_DONE  (via drill 0.25, 0.35)
  Top(3v3+) 0.203: v50.08,71.73 55.06,66.75 55.77,66.75 59.15,63.38 v59.33,63.38 | v55.24,59.29 55.24,58.58 56.12,57.69 56.12,56.98 55.06,55.91 55.06,33.72 53.81,32.47 53.81,31.45 52.14,29.77 49.55,29.77 48.56,28.78 U$14.1/TX
  Top(3v3+) 0.254: DONE.P$1 38.05,83.23 37,84.28 37,93.04 38.02,94.06 41.3,94.06 41.32,94.05 | 42.19,94.06 42.21,94.05
  Top(3v3+) 0.305: CHARGE_U.P$2 42.21,94.05 41.32,94.05 41.18,94.05 40.94,93.81 40.94,92.95 R22.2 40.94,92.81 40.94,89.87 41.37,89.44 R12.2
  Bottom(3v3GND) 0.203: v50.08,71.73 40.3,81.51 DONE.P$1 | v59.33,63.38 59.33,63.2 55.41,59.29 v55.24,59.29
CHIP  (via drill 0.35)
  Top(3v3+) 0.203: ANDS.P$3 64.22,71.82 v64.13,71.91 | v63.24,74.05 62.53,74.05 62.35,74.22 | U$1.3 62.6,78.75 62.26,78.4 62.26,74.31 62.35,74.22 | CHIP_LED.A 15.99,86.09 20.39,81.69 20.39,77.07 21.1,76.36 54.17,76.36 56.66,73.87 61.99,73.87 62.35,74.22
  Bottom(3v3GND) 0.203: v64.13,71.91 63.24,72.8 v63.24,74.05
CHIP_ENABLE  (via drill 0.25, 0.3)
  Top(3v3+) 0.203: CE_LED.A 24.73,86.95 25.37,86.31 26.79,86.31 27.5,85.6 v27.5,83.65 | ANDS.P$6 72.75,71.82 73.02,71.56 73.02,70.67 72.66,70.31 65.55,70.31 64.84,69.6 54.88,69.6 51.5,72.98 50.26,72.98 49.19,71.91 49.19,71.02 49.01,70.84 47.77,70.84 v46.88,71.73 52.92,65.69 54.35,65.69 60.75,59.29 v60.93,59.29 | v58.26,56.44 58.26,55.02 60.93,52.35 60.93,45.77 59.88,44.73 59.88,42.85 58.72,41.68 U$14.5
  Bottom(3v3GND) 0.203: v46.88,71.73 37.1,81.51 29.63,81.51 v27.5,83.65 | v60.93,59.29 58.26,56.62 v58.26,56.44
COMP_OUT  (via drill 0.3)
  Top(3v3+) 0.203: R29.2 68.39,75.19 68.39,76 68.93,76.53 68.93,80.62 69.46,81.16 69.46,84.36 69.52,84.42 U$22.G 71.36,84.42 71.59,84.18 71.59,83.11 72.66,82.05 v74.27,82.05
  Top(3v3+) 0.254: ANDS.P$5 70.43,71.17 68.52,73.08 | 68.52,73.08 66.89,73.08 ANDS.P$1 | 68.52,73.08 68.52,74.8 R29.2
  Bottom(3v3GND) 0.203: U$18.7 79.15,87.11 74.26,82.22 v74.26,82.05 v74.27,82.05
CS_0  (via drill 0.25)
  Top(3v3+) 0.305: C22.1 38.53,50.23 39.41,51.11 | R36.1 39.23,55.02 39.41,54.84 39.41,51.11 | 39.41,51.11 39.41,50.93 40.66,49.69 v42.97,49.69
  Bottom(3v3GND) 0.305: U$14.22/A8 49.52,48.09 42.97,48.09 v42.97,49.69
CS_1  (via drill 0.35)
  Top(3v3+) 0.406: C28.1 38.88,30.66 39.59,31.37 39.59,34.75 39.32,35.02 | R65.1 39.23,35.11 39.32,35.02 | v45.1,48.8 41.01,48.8 38.7,46.49 38.7,39.55 39.59,38.66 39.59,35.28 39.32,35.02
  Bottom(3v3GND) 0.305: 48.84,48.8 49.55,48.8 53.1,45.24 55.24,45.24 56.18,44.3 U$14.21/A7
  Bottom(3v3GND) 0.406: v45.1,48.8 48.84,48.8
CS_2  (via drill 0.25)
  Top(3v3+) 0.203: v90.44,48.62 90.44,50.08 93.09,52.72 93.09,54.47 92.03,55.53 R76.1
  Top(3v3+) 0.305: C32.1 91.67,58.93 91.33,58.93 91.15,58.75 91.15,56.8 92.03,55.92 R76.1 | U$14.37/A18 90.82,44.89 v90.44,44.89
  Bottom(3v3GND) 0.305: v90.44,44.89 v90.44,48.62
CS_3  (via drill 0.25)
  Top(3v3+) 0.152: C45.1 v104.74,39.02 | v104.74,39.02 105.02,38.67 105.02,35.29 105.2,35.11 R87.1 | 104.66,40.8 102.53,40.8 102.53,40.97 | 104.66,40.8 104.74,40.8 | 104.66,40.8 104.74,40.72 v104.74,39.02
  Top(3v3+) 0.203: U$14.36/A17 95.67,42.57 100.93,42.57 102.53,40.97
CTS  (via drill 0.25)
  Top(3v3+) 0.152: R30.1 128.67,81.51 119.6,72.45 119.6,70.31 125.09,64.83 126.91,64.83 127.98,63.76 127.98,49.48 126.2,47.7 121.9,47.7 120.02,45.83 110.94,45.83 109.11,44 109.11,42.93 v108.4,42.22 | v100.93,41.15 100.93,36.71 100.42,36.2 99,36.2 93.89,31.1 93.89,31.09 93.11,30.31 88.54,30.31 87.6,31.25 82.31,31.25 81.73,30.66 v81.73,30.84
  Bottom(3v3GND) 0.152: v108.4,42.22 107.94,42.22 107.74,42.02 107.28,42.02 107.08,42.22 102,42.22 v100.93,41.15 | v81.73,30.84 81.58,30.69 U$14.24
DISCHARGE  (via drill 0.25, 0.3)
  Top(3v3+) 0.152: 37.49,82.4 37.28,82.4 v37.1,82.58
  Top(3v3+) 0.203: R26.1 20.06,91.44 23.94,87.56 27.14,87.56 28.39,86.31 v28.39,85.6 | v41.9,78.31 41.72,78.31 37.49,82.4 | v57.19,57.33 57.37,57.15 57.37,33.86 56.12,32.62 56.12,28.78 U$14.4/CANRX | v60.75,60.89 55.41,66.22 53.81,66.22 v50.61,69.42
  Bottom(3v3GND) 0.203: 37.28,82.58 v37.1,82.58 30.17,82.58 28.39,84.36 v28.39,85.6 | 49.72,70.31 49.64,70.41 | 49.64,70.41 42.24,78.29 v41.9,78.31 | v60.75,60.89 v57.19,57.33 | 49.64,70.41 v50.62,69.42 v50.61,69.42
DIVCAP
  Bottom(3v3GND) 0.203: R8.1 102.18,109.02 102.15,109.05
  Bottom(3v3GND) 0.254: R8.1 103.79,110.15 104.13,110.49 112.49,110.49 114.28,108.7 CAP/100.P$1
  Bottom(3v3GND) 0.305: CAP_SENSE_BUF.1 100.32,110.75 100.5,110.57 102.15,110.57 102.15,109.05 CAP_SENSE_BUF.4
DRIB  (via drill 0.25, 0.3)
  Top(3v3+) 0.203: v45.28,71.91 52.04,65.16 53.64,65.16 v61.28,57.51 | U$14.6 61.26,42.57 62.25,43.56 62.25,52.45 v59.15,55.55
  Bottom(3v3GND) 0.203: v45.28,71.91 36.57,80.62 28.74,80.62 26.43,82.94 24.1,82.94 DRIB_TEST.P$1 | v61.28,57.51 59.33,55.55 v59.15,55.55
  Bottom(3v3GND) 0.305: DRIB_TEST.P$1 24.09,85.13 DRIB_TRAN.GATE
ENA_0  (via drill 0.35)
  Top(3v3+) 0.305: v37.28,58.4 37.45,58.23 37.71,58.23 37.82,58.34 42.98,58.34 43.09,58.23 U$17.2
  Bottom(3v3GND) 0.305: R42.1 38.71,52.89 R39.1 38.52,52.7 38.52,51.64 36.39,51.64 35.68,50.93 35.14,50.93 34.61,51.46 34.61,56.62 36.21,58.22 37.1,58.22 v37.28,58.4
ENA_1  (via drill 0.35)
  Top(3v3+) 0.406: U$17.27 49.73,58.23 48.48,56.98 48.48,49.33 48.84,48.98 48.84,48.26 47.95,47.38 47.95,47.02 49.9,45.06 49.9,43.46 48.66,42.22 v48.66,34.22
  Bottom(3v3GND) 0.406: R67.1 R70.1 40.83,33.68 40.83,32.62 40.97,32.48 42.57,32.48 42.88,32.79 42.88,34.22 v48.66,34.22
ENA_2  (via drill 0.25)
  Top(3v3+) 0.305: U$21.27 86.77,58.81 87.77,59.82 90.26,59.82 v90.62,59.47
  Bottom(3v3GND) 0.305: R78.1 R81.1 90.26,57.88 90.26,58.75 90.62,59.11 v90.62,59.47
ENA_3  (via drill 0.25)
  Top(3v3+) 0.305: U$21.2 81.31,58.81 82.52,57.61 82.52,50.74 83.68,49.57 83.68,49.15 v83.51,49.15 | v84.22,46.13 87.23,46.13 87.69,45.68 88.21,45.68 88.57,46.03 103.95,46.03 v103.95,41.51
  Bottom(3v3GND) 0.152: R92.1 104.13,37.24 | 104.13,37.24 R89.1 | v103.95,41.51 103.95,39.91 104.13,39.73 104.13,37.24
  Bottom(3v3GND) 0.305: v83.51,49.15 84.22,48.44 v84.22,46.13
ENB_0  (via drill 0.35)
  Top(3v3+) 0.254: v41.23,57.29 41.52,57.58 U$17.3
  Bottom(3v3GND) 0.305: R40.1 R41.1 41.01,55.02 41.23,55.24 v41.23,57.29
ENB_1  (via drill 0.35)
  Top(3v3+) 0.406: v49.01,47.38 49.75,48.11 49.75,49.1 49.19,49.66 49.19,56.8 49.97,57.58 U$17.26 | v45.99,47.38 41.9,47.38 39.77,45.24 39.77,40.26 v40.66,39.37
  Bottom(3v3GND) 0.406: R68.1 R69.1 40.11,37.41 40.66,37.95 v40.66,39.37 | v49.01,47.38 v45.99,47.38
ENB_2  (via drill 0.25)
  Top(3v3+) 0.305: v89.55,53.95 89.37,53.78 87.95,53.78 87.6,54.13 87.6,57.69 87.06,58.23 85.51,58.23 U$21.26
  Bottom(3v3GND) 0.305: R79.1 R80.1 89.73,55.02 89.55,54.84 v89.55,53.95
ENB_3  (via drill 0.25)
  Top(3v3+) 0.152: 103.22,34.91 103.22,38.87 102.35,39.73 102.35,39.91 v102.53,40.09 | v103.06,41.66 103.06,41.86
  Top(3v3+) 0.203: v82.8,46.13 83.32,46.13 84.23,45.22 88.4,45.22 88.76,45.57 103.42,45.57 103.42,42.22 103.06,41.86 | v103.6,32.97 103.6,34.4 103.22,34.91
  Top(3v3+) 0.305: U$21.3 81.25,58.16 81.91,57.51 81.91,49.51 v82.26,49.15
  Bottom(3v3GND) 0.152: v102.53,40.09 102.53,41.33 102.89,41.69 102.91,41.66 v103.06,41.66
  Bottom(3v3GND) 0.305: R90.1 R91.1 103.6,34.74 v103.6,32.97 | v82.26,49.15 82.26,46.49 82.62,46.13 v82.8,46.13
GND  (via drill 0.25, 0.3, 0.35, 0.5)
  Top(3v3+) 0.152: R93.1 103.95,39.02 v103.55,39.37 | 9.19,101.25 8.74,100.8 v8.74,95.71 | 16.81,87.73 16.78,87.76 15.19,87.76 15.06,87.63 15.06,86.24 19.05,82.25 R4.2 | 16.81,87.73 17.72,87.73 18.25,88.27 18.25,88.45 18.61,88.8 20.03,88.8 20.39,89.16 20.39,90.65 19.5,91.54 19.5,93.96 18.54,93.96 R5.2 | 16.81,87.73 17.54,87 17.54,85.25 20.92,81.87 28.39,81.87 v28.39,79.38 | v34.43,79.38 34.43,83.47 34.61,83.65 | v85.46,50.22 85.46,51.65 U$21.16
  Top(3v3+) 0.203: U$22.S 70.53,82.43 70.53,81.34 v71.42,80.45 71.47,80.39 71.47,78.83 72.13,78.17 v72.13,77.78 | R4.2 16.6,80.87 R9.1 16.57,81.59 v13.63,84.53 | R5.2 16.66,95.71 v8.74,95.71 | R11.2 34.47,83.65 34.61,83.65 36.21,83.65 v36.21,83.47 37.1,83.47 40.83,79.73 50.26,79.73 v51.5,78.49 | U$5.2 17.84,101.25 9.19,101.25 | v64.48,70.67 64.98,71.17 ANDS.P$4 68.9,71.17 v69.11,71.38 | R55.2 121.06,51.41 R47.2 121.08,51.29 v122.09,51.29 | v100.93,79.02 108.75,79.02 v111.42,76.36 | v99.51,68.89 98.26,67.64 v98.09,67.64 | v80.66,52 80.66,52.01 79.23,53.44 79.22,53.44 78.88,53.78 78.41,53.78 U$21.10
  Top(3v3+) 0.254: C15.2 70.99,69.1 v71.21,69.12
  Top(3v3+) 0.305: R10.1 18.44,93.87 R5.2 | C10.1 122.27,92.71 121.38,91.83 v121.38,92 | R59.2 9.53,59.11 R51.2 8.22,60.96 v8.12,61.06 | R83.1 C32.2 v94.78,59.29 | 98.49,18.85 C12.2 98.85,21.58 v99.75,22.48 | 98.49,18.85 BB_CON.3 | BB_CON.5 94.44,18.75 94.44,18.13 95.24,17.33 97.91,17.33 98.49,17.91 98.49,18.85 | C22.2 36.73,50.56 37.1,50.93 v37.63,50.93 | U$17.17 53.37,51.73 v53.46,51.82 | JP2.3 7.74,35.26 v7.76,35.28 | R45.2 10.47,41.33 v9.19,41.33 | U$21.10 76.23,53.62 v76.22,53.6 | U$21.16 U$21.15 | R93.1 | v108.58,39.02 C45.2 R94.1 107.74,36.85 v109.15,36.85 | v136.85,27.28 136.85,26.57 136.67,26.39 135.97,26.39 R49.2 135.79,27.82 R57.2 135.74,27.82 134.89,27.82 134.89,23.19 138.45,23.19 140.94,25.68 140.94,31.73 v141.29,32.08 | 36.91,32.26 v36.91,31.91 | v40.12,30.13 40.48,30.13 40.66,30.31 40.65,30.32 R71.1 40.65,32.43 41.74,33.53 41.74,34.59 41.92,34.77 42.31,34.77 v42.65,35.11 | R60.1 41.01,51.1 v41.01,50.37 | R82.1 89.37,57.69 v89.37,59.01 | R61.1 37.63,51.81 v37.63,50.93 | v37.63,50.93 37.63,46.49 v37.46,46.31 | v75.86,34.57 82.62,41.33 v82.62,42.04 | v140.76,35.11 139.36,33.71 JP4.3 | v83.86,56.44 83.86,59.82 84.75,60.71 v86.53,60.71 | D2.A 53.5,15.34 53.5,13.77 52.81,13.09 48.61,13.09 47.74,12.22 47.74,6.62 46.21,5.08 43.29,5.08 38.69,9.68 C39.2
  Top(3v3+) 0.406: v36.91,31.91 C28.2 36.91,30.56 37.67,29.81 37.67,27.96 v37.81,27.82 | R72.1 36.91,32.26 | U$17.17 U$17.16 U$17.15 | C10.1 C1.1 | U$17.10 44.42,52.96 43.47,52.96 43.15,52.64 43.15,51.46 v43.14,51.46 | v68.93,36.81 v68.93,34.75 | U$21.16 85.47,51.64 v87.24,51.64 | v40.66,24.08 40.3,23.73 C11.2 C8.2 C9.2 38.2,9.18 | C39.2 38.62,9.68 43.27,5.03 45.52,5.03 45.55,5.06 47.77,5.06 47.77,8.44 47.23,8.97 IC1.4 | GND.P$1 85.08,21.24 94.35,21.24 94.44,21.16 94.44,18.75 | v9.36,40.09 10.02,39.43 R53.2 | R59.2 9.5,58.83 10.29,58.05 10.29,56.56 10.08,56.35 7.16,56.35 JP1.3 | D2.A 65.75,24.44 66.1,24.08 69.52,24.08 U$19.2
  Top(3v3+) 0.508: R45.2 10.62,41.08 R53.2
  Top(3v3+) 1.27: U$19.2 73.98,25.07 76.22,22.84 82.78,22.84 GND.P$1
  Bottom(3v3GND) 0.152: v28.39,79.38 v34.43,79.38 | v71.21,69.12 73.96,69.12 74.72,69.88 74.72,75.01 74.79,75.08 74.79,76.18 | v71.42,80.45 72.05,79.81 72.61,79.81 74.79,77.62 74.79,76.18 | v76.22,53.6 76.22,61.15 77.02,61.95 77.02,73.95 74.79,76.18 | C38.2 84.02,51.66 v85.46,50.22
  Bottom(3v3GND) 0.203: v51.5,78.49 51.5,73.69 53.1,72.09 62.35,72.09 63.95,70.49 64.3,70.49 v64.48,70.67 | v121.38,92 117.82,92 117.82,79.73 117.69,79.6 U$15.10 114.67,79.6 v111.42,76.36 | v72.13,77.78 72.13,76.99 70.92,75.79 70.92,72.84 69.46,71.38 v69.11,71.38 | C33.2 94.31,88.97 U$18.1 93.58,88.38 92.57,87.38 92.57,85.07 93.07,84.57 U$18.4 99.85,79.02 v100.93,79.02 100.93,70.49 99.51,69.07 v99.51,68.89 | v89.37,59.01 89.37,61.6 90.44,62.67 94.17,62.67 94.78,62.06 v94.78,59.29 95.42,59.29 95.24,59.47 95.24,63.91 98.09,66.75 v98.09,67.64 | v37.46,46.31 38.34,47.2 39.2,47.2 40.02,48.01 41.01,48.01 | v80.66,52 80.7,52.04 81.96,52.04 C37.2
  Bottom(3v3GND) 0.254: v71.21,69.12 71.01,69.17 71.16,69.32
  Bottom(3v3GND) 0.305: C35.2 44.19,52.55 C36.2 43.14,51.55 v43.14,51.46 42.07,51.46 41.45,50.84 41.45,50.8 v41.01,50.37 | v42.65,35.11 42.65,40.6 U$14.AGND | v99.75,22.48 94.89,22.48 94.17,23.19 94.17,27.11 95.77,28.71 95.77,29.16 99.48,32.87 102.08,32.87 102.9,33.7 | 102.9,33.7 102.9,37.97 103.55,38.61 v103.55,39.37 | 102.9,33.7 102.9,32.77 103.34,32.34 107.95,32.34 109.56,33.95 109.56,36.08 109.15,36.5 v109.15,36.85 | C13.1 73.72,34.57 v75.86,34.57 | v82.62,42.04 81.84,42.04 81.21,42.68 80.33,42.68 U$14.GND2 80.56,45.5 84.48,45.5 84.85,45.87 84.85,48.7 82.31,51.24 C37.2 82.34,51.66 C38.2 83.75,51.64 | JP3.3 122.09,54.87 v122.09,51.29 122.93,50.45 122.93,49.47 125.2,47.2 136.67,47.2 137.02,46.84 137.02,33.68 137.2,33.51 138.78,33.51 JP4.3 | v141.29,32.08 140.76,32.62 v140.76,35.11 | v87.24,51.64 85.69,53.19 85.69,55.72 85.45,55.96 84.34,55.96 v83.86,56.44 | v86.53,60.71 87.67,60.71 v89.37,59.01
  Bottom(3v3GND) 0.406: U$8.1 68.93,37.6 v68.93,36.81 | v37.81,27.82 v40.12,30.13 40.12,24.62 v40.66,24.08 40.66,25.91 U$14.GND 43.48,25.89 43.5,25.86 61.18,25.86 D2.A 62.6,29.08 63.34,29.82 64,29.82 v68.93,34.75 71.41,34.75 C13.1 | v7.76,35.28 7.76,38.48 v9.36,40.09 | v9.19,41.33 9.19,51.26 JP1.3 | v8.12,61.06 8.33,61.28 27.27,61.28 27.48,61.49 27.48,78.47 v28.39,79.38 | C35.2 48.21,52.55 48.43,52.33 52.95,52.33 v53.46,51.82 | U$14.AGND 42.59,47.4 41.62,47.4 41.01,48.01 v41.01,50.37 | v108.58,39.02 108.65,39.02 109.62,38.06 109.62,33.56 107.72,31.66 107.72,30.38 108.11,29.98 119.34,29.98 120.35,30.99 133.14,30.99 v136.85,27.28
  pour Bottom(3v3GND): 66.08,-10.59 117.47,-10.59 146.09,18.04 146.09,109.07 111.42,143.74 33.01,143.74 -5.04,105.69 -5.04,20.53 25.72,-10.23 65.73,-10.23
INA_0  (via drill 0.35)
  Top(3v3+) 0.305: v40.12,48.98 39.59,48.44 R63.2 | v46.17,58.93 44.54,58.93 U$17.1
  Bottom(3v3GND) 0.305: v40.12,48.98 40.12,50.58 41.53,51.98 42.62,51.98 42.79,52.16 42.79,52.89 43.32,53.42 46.88,53.42 47.23,53.78 47.23,57.69 45.99,58.93 v46.17,58.93
INA_1
  Top(3v3+) 0.406: R74.2 41.55,29.06 47.82,35.34 47.82,42.88 47.41,43.29 47.41,46.66 47.23,46.84 47.23,47.73 47.77,48.26 47.82,57.19 49.51,58.88 U$17.28
INA_2
  Top(3v3+) 0.305: R85.2 91.85,60.89 87.95,60.89 86.53,59.47 U$21.28
INA_3  (via drill 0.25)